# Altium project Timingcard_PROJECT_v9.PrjPcb (part 2 of 2)

## Sheet 05-GPS_IMU_SENSORS.SchDoc
size Tabloid; Customer: 01910; SPICEModelCache: <root> / <DocumentId>YSTRYKDD</DocumentId> / <CacheFrame Number="0"> / <Model Name="emk105bj105_v-f" Kind="CKT"> / <Text>* EMK105BJ105_V-F     SPICE MODEL  ( General Type ) / *-------------------------------------------------------------------------------------------------------- / * Model Generated by TAIYO YUDEN Corporation (http://www.ty-top.com) / * Version 1.0 / * TAIYO YUDEN Control No. 170508_130520 / * Copyright(c) 2012 TAIYO YUDEN CO.,LTD. All Rights Reserved. / *-------------------------------------------------------------------------------------------------------- / * / * Products Name : Multilayer Ceramic Capacitors / * / * Characteristics : / *     Capacitance : 1 uF , Rated Voltage : 16V , TCC : X5R / *     Case Size : 1.0 x 0.5 / 0.039 x 0.02 [mm/inch] , Thickness : 0.5 / 0.02 [mm/inch] / *     (Conditions: Temperature = 25 degC , DC Bias Current/Voltage = 0A / 0V) / * / * Frequency Range : 40Hz - 3GHz / * / * External Node Assignments : / * / *  1  o---| |---o  2 / * / *-------------------------------------------------------------------------------------------------------- / .SubCkt EMK105BJ105_V-F 1 2 / **************************** / C0 1 110 0.68309u / Cm 1 101 0.26053u / C1 101 102 0.94076u / Rc1 101 102 1.9029k / C2 102 103 0.66707u / Rc2 102 103 120.36 / C3 103 110 0.57203u / Rc3 103 110 2.1097 / C2m 1 301 0.1871u / C21 301 302 3.2494u / Rc21 301 302 1.1117k / C22 302 303 2.1014u / Rc22 302 303 1.484k / C23 303 304 2.1172u / Rc23 303 304 1.3876k / C24 304 305 0.75729u / Rc24 304 305 332.59 / C25 305 306 0.94401u / Rc25 305 306 249.09 / C26 306 307 0.34674u / Rc26 306 307 28.352 / C27 307 308 0.37158u / Rc27 307 308 19.989 / C28 308 309 0.17933u / Rc28 308 309 31.748 / C29 309 110 0.016445u / Rc29 309 110 1.0592 / Rp0 1 110 100Meg / L0 110 120 0.2216n / Lm 120 130 0.1509n / L1 120 121 0.12659n / RL1 121 130 0.85161 / L2 120 122 0.15996n / RL2 122 130 0.42469 / L3 120 123 7.9543n / RL3 123 130 0.54643m / CR 120 124 0.24334u / LR 124 125 0.090738n / RR 125 130 68.076m / CL 130 140 2.7354p / LL 130 140 0.10762n / RL 130 140 50.614 / Rs 140 2 7.5416m / **************************** / .ends EMK105BJ105_V-F</Text> / </Model> / </CacheFrame> / </root>
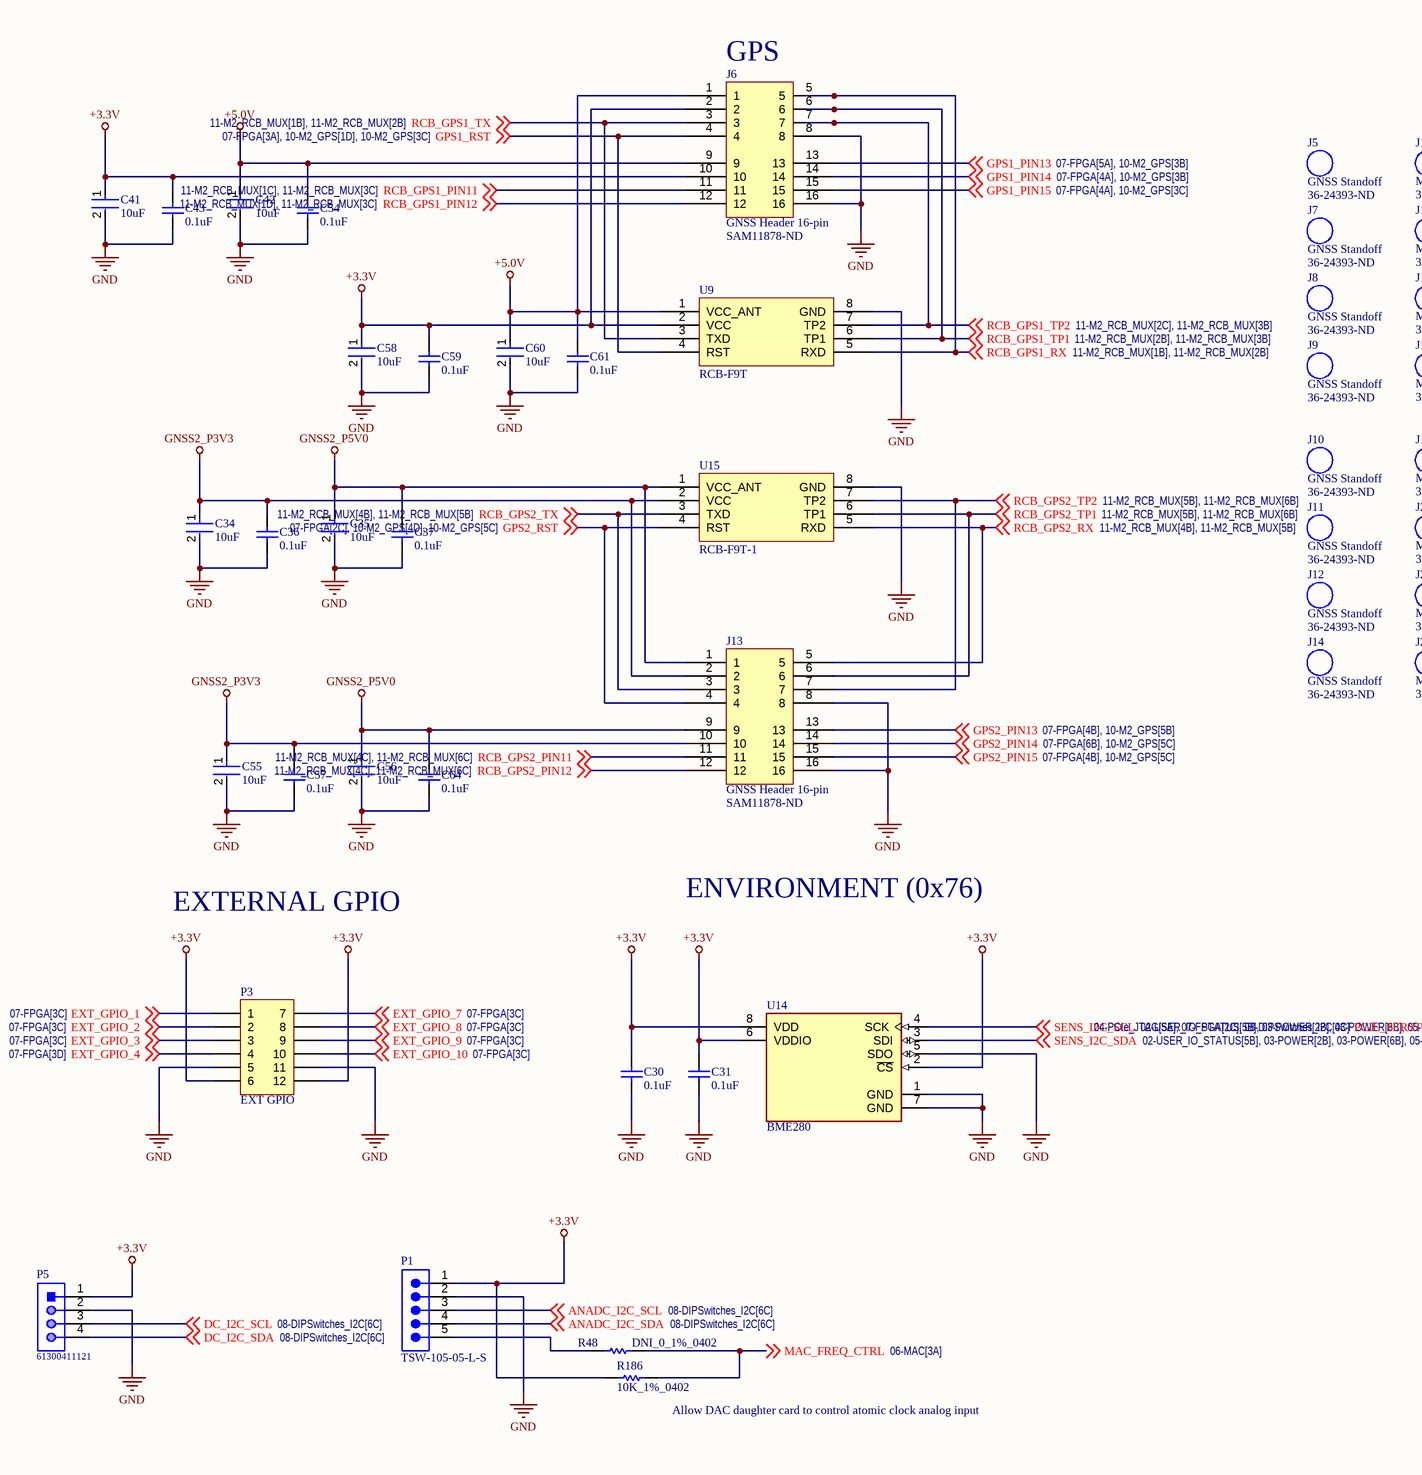
[diagram p3: 05-GPS_IMU_SENSORS.SchDoc, left]
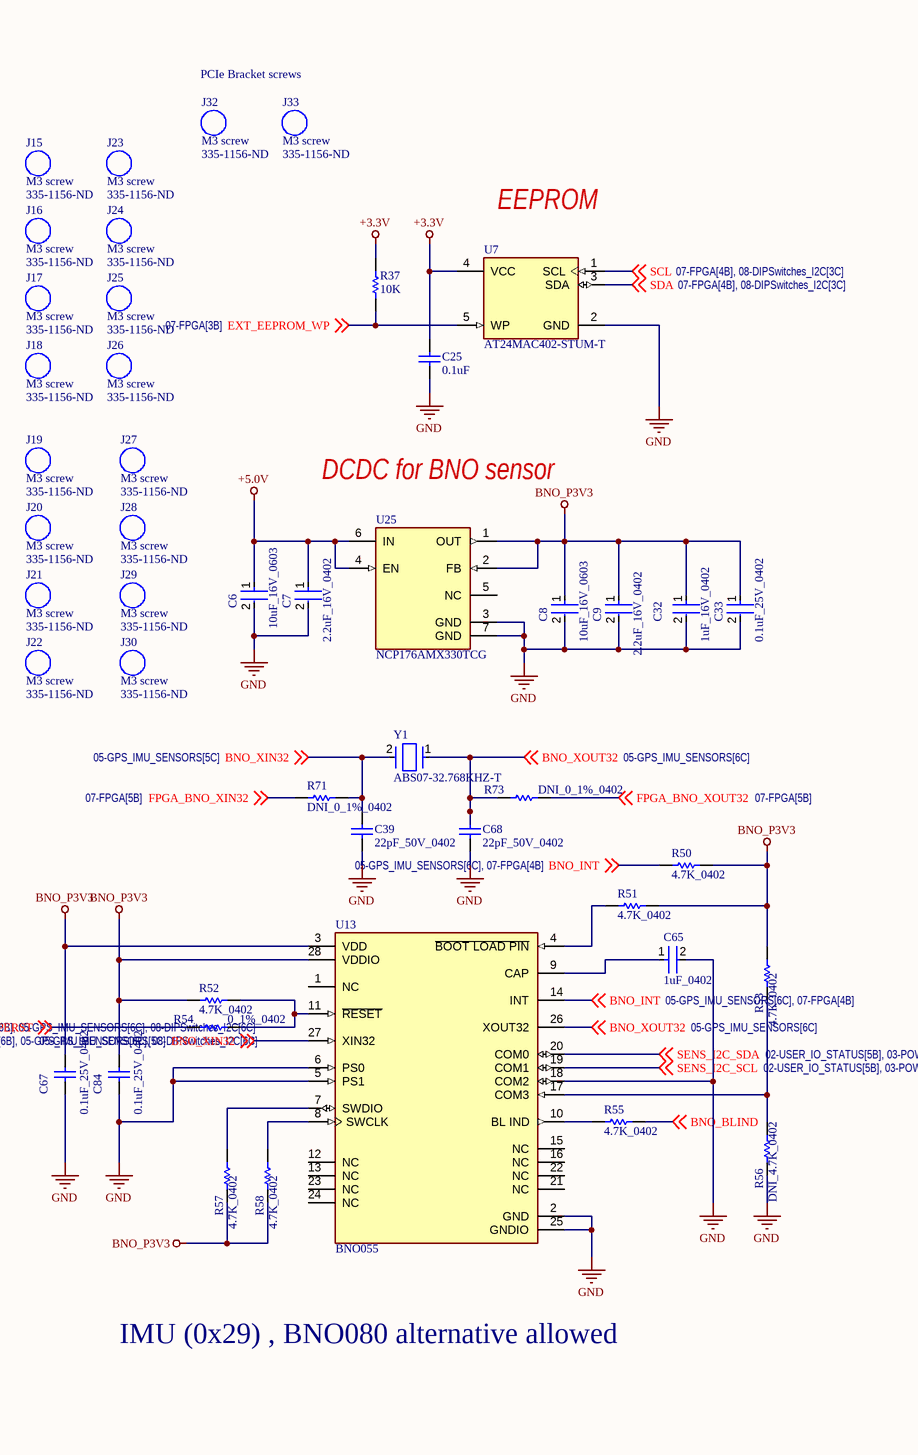
[diagram p4: 05-GPS_IMU_SENSORS.SchDoc, right]

### Parts
C6  10uF_16V_0603  [FP-0603-L_1_6_0_2-W_0_8_0-MFG]
C7  2.2uF_16V_0402  [FP-C1005-050-0_05-IPC_A]
C8  10uF_16V_0603  [FP-0603-L_1_6_0_2-W_0_8_0-MFG]
C9  2.2uF_16V_0402  [FP-C1005-050-0_05-IPC_A]
C25  0.1uF  [CAPC1608X87X45ML20T05]
C30  0.1uF  [CAPC1608X87X45ML20T05]
C31  0.1uF  [CAPC1608X87X45ML20T05]
C32  1uF_16V_0402  [FP-0402-L_1_0_0_05-W_0_5-IPC_A]
C33  0.1uF_25V_0402  [FP-0402-L_1_0_1-W_0_5_0_1-IPC_C]
C34  10uF  [FP-MK212BG-MFG]
C35  10uF  [FP-MK212BG-MFG]
C36  0.1uF  [CAPC1608X87X45ML20T05]
C37  0.1uF  [CAPC1608X87X45ML20T05]
C39  22pF_50V_0402  [CAPC1005X55X25ML05T05]
C41  10uF  [FP-MK212BG-MFG]
C42  10uF  [FP-MK212BG-MFG]
C43  0.1uF  [CAPC1608X87X45ML20T05]
C54  0.1uF  [CAPC1608X87X45ML20T05]
C55  10uF  [FP-MK212BG-MFG]
C56  10uF  [FP-MK212BG-MFG]
C57  0.1uF  [CAPC1608X87X45ML20T05]
C58  10uF  [FP-MK212BG-MFG]
C59  0.1uF  [CAPC1608X87X45ML20T05]
C60  10uF  [FP-MK212BG-MFG]
C61  0.1uF  [CAPC1608X87X45ML20T05]
C64  0.1uF  [CAPC1608X87X45ML20T05]
C65  1uF_0402  [FP-0402-L_1_0_0_05-W_0_5-IPC_C]
C67  0.1uF_25V_0402  [CAPC1005X56X25NL10T15]
C68  22pF_50V_0402  [CAPC1005X55X25ML05T05]
C84  0.1uF_25V_0402  [CAPC1005X56X25NL10T15]
J5  GNSS Standoff  Supplier Part Number 1: 36-24393-ND
J6  GNSS Header 16-pin  Supplier Part Number 1: SAM11878-ND  [GNSS Header 16-pin]
J7  GNSS Standoff  Supplier Part Number 1: 36-24393-ND
J8  GNSS Standoff  Supplier Part Number 1: 36-24393-ND
J9  GNSS Standoff  Supplier Part Number 1: 36-24393-ND
J10  GNSS Standoff  Supplier Part Number 1: 36-24393-ND
J11  GNSS Standoff  Supplier Part Number 1: 36-24393-ND
J12  GNSS Standoff  Supplier Part Number 1: 36-24393-ND
J13  GNSS Header 16-pin  Supplier Part Number 1: SAM11878-ND  [GNSS Header 16-pin]
J14  GNSS Standoff  Supplier Part Number 1: 36-24393-ND
J15  M3 screw  Supplier Part Number 1: 335-1156-ND
J16  M3 screw  Supplier Part Number 1: 335-1156-ND
J17  M3 screw  Supplier Part Number 1: 335-1156-ND
J18  M3 screw  Supplier Part Number 1: 335-1156-ND
J19  M3 screw  Supplier Part Number 1: 335-1156-ND
J20  M3 screw  Supplier Part Number 1: 335-1156-ND
J21  M3 screw  Supplier Part Number 1: 335-1156-ND
J22  M3 screw  Supplier Part Number 1: 335-1156-ND
J23  M3 screw  Supplier Part Number 1: 335-1156-ND
J24  M3 screw  Supplier Part Number 1: 335-1156-ND
J25  M3 screw  Supplier Part Number 1: 335-1156-ND
J26  M3 screw  Supplier Part Number 1: 335-1156-ND
J27  M3 screw  Supplier Part Number 1: 335-1156-ND
J28  M3 screw  Supplier Part Number 1: 335-1156-ND
J29  M3 screw  Supplier Part Number 1: 335-1156-ND
J30  M3 screw  Supplier Part Number 1: 335-1156-ND
J32  M3 screw  Supplier Part Number 1: 335-1156-ND
J33  M3 screw  Supplier Part Number 1: 335-1156-ND
P1  TSW-105-05-L-S  [SMTC-TSW-105-05-X-S]
P3  EXT GPIO  [HDR2X6_CEN]
P5  61300411121  [61300411121]
R37  10K  [RESC1608X55X30LL15T20]
R48  DNI_0_1%_0402  [RESC1005X40X25LL05T05]  (no BOM)
R50  4.7K_0402  [RESC1005X40X25LL05T05]
R51  4.7K_0402  [RESC1005X40X25LL05T05]
R52  4.7K_0402  [RESC1005X40X25LL05T05]
R53  4.7K_0402  [RESC1005X40X25LL05T05]
R54  0_1%_0402  [RESC1005X40X25LL05T05]
R55  4.7K_0402  [RESC1005X40X25LL05T05]
R56  DNI_4.7K_0402  [RESC1005X40X25LL05T05]  (no BOM)
R57  4.7K_0402  [RESC1005X40X25LL05T05]
R58  4.7K_0402  [RESC1005X40X25LL05T05]
R71  DNI_0_1%_0402  [RESC1005X40X25LL05T05]  (no BOM)
R73  DNI_0_1%_0402  [RESC1005X40X25LL05T05]  (no BOM)
R186  10K_1%_0402  [RESC1005X40X25LL05T10]
U7  AT24MAC402-STUM-T  [FP-5TS1-IPC_C]
U9  RCB-F9T  [GNSS]
U13  BNO055  [FP-BNO055-MFG]
U14  BME280  [FP-BME280-MFG]
U15  RCB-F9T-1  [GNSS]
U25  NCP176AMX330TCG  [FP-711AT-MFG]
Y1  ABS07-32.768KHZ-T  [FP-ABS07-MFG]

### Nets
+3.3V: C25.2 C30.2 C31.2 C41.1 C43.2 C58.1 C59.2 J6.2 J6.10 P1.1 P3.6 P3.12 P5.1 R37.2 R186.1 U7.4(VCC) U9.2(VCC) U14.2(~{CS}) U14.6(VDDIO) U14.8(VDD)
+5.0V: C6.1 C7.1 C42.1 C54.2 C60.1 C61.2 J6.1 J6.9 U9.1(VCC_ANT) U25.4(EN) U25.6(IN)
BNO_P3V3: C8.1 C9.1 C32.1 C33.1 C67.2 C84.2 R50.1 R51.1 R52.2 R53.2 R57.1 R58.1 U13.3(VDD) U13.28(VDDIO) U25.1(OUT) U25.2(FB)
GND: C6.2 C7.2 C8.2 C9.2 C25.1 C30.1 C31.1 C32.2 C33.2 C34.2 C35.2 C36.1 C37.1 C39.1 C41.2 C42.2 C43.1 C54.1 C55.2 C56.2 C57.1 C58.2 C59.1 C60.2 C61.1 C64.1 C65.2 C67.1 C68.1 C84.1 J6.8 J6.16 J13.8 J13.16 P1.2 P3.5 P3.11 P5.2 R56.1 U7.2(GND) U9.8(GND) U13.2(GND) U13.5(PS1) U13.6(PS0) U13.18(COM2) U13.25(GNDIO) U14.1(GND) U14.5(SDO) U14.7(GND) U15.8(GND) U25.3(GND) U25.7(GND)
GNSS2_P3V3: C34.1 C36.2 C55.1 C57.2 J13.2 J13.10 U15.2(VCC)
GNSS2_P5V0: C35.1 C37.2 C56.1 C64.2 J13.1 J13.9 U15.1(VCC_ANT)
ANADC_I2C_SCL: P1.3 ; off-sheet ANADC_I2C_SCL
ANADC_I2C_SDA: P1.4 ; off-sheet ANADC_I2C_SDA
BNO_BLIND: R55.1 ; off-sheet BNO_BLIND
BNO_INT: R50.2 U13.14(INT) ; off-sheet BNO_INT
BNO_XIN32: C39.2 R71.1 U13.27(XIN32) Y1.2 ; off-sheet BNO_XIN32
BNO_XOUT32: C68.2 R73.1 U13.26(XOUT32) Y1.1 ; off-sheet BNO_XOUT32
DC_I2C_SCL: P5.3 ; off-sheet DC_I2C_SCL
DC_I2C_SDA: P5.4 ; off-sheet DC_I2C_SDA
EXT_EEPROM_WP: R37.1 U7.5(WP) ; off-sheet EXT_EEPROM_WP
EXT_GPIO_1: P3.1 ; off-sheet EXT_GPIO_1
EXT_GPIO_2: P3.2 ; off-sheet EXT_GPIO_2
EXT_GPIO_3: P3.3 ; off-sheet EXT_GPIO_3
EXT_GPIO_4: P3.4 ; off-sheet EXT_GPIO_4
EXT_GPIO_7: P3.7 ; off-sheet EXT_GPIO_7
EXT_GPIO_8: P3.8 ; off-sheet EXT_GPIO_8
EXT_GPIO_9: P3.9 ; off-sheet EXT_GPIO_9
EXT_GPIO_10: P3.10 ; off-sheet EXT_GPIO_10
FPGA_BNO_XIN32: R71.2 ; off-sheet FPGA_BNO_XIN32
FPGA_BNO_XOUT32: R73.2 ; off-sheet FPGA_BNO_XOUT32
GPS1_PIN13: J6.13 ; off-sheet GPS1_PIN13
GPS1_PIN14: J6.14 ; off-sheet GPS1_PIN14
GPS1_PIN15: J6.15 ; off-sheet GPS1_PIN15
GPS1_RST: J6.4 U9.4(RST) ; off-sheet GPS1_RST
GPS2_PIN13: J13.13 ; off-sheet GPS2_PIN13
GPS2_PIN14: J13.14 ; off-sheet GPS2_PIN14
GPS2_PIN15: J13.15 ; off-sheet GPS2_PIN15
GPS2_RST: J13.4 U15.4(RST) ; off-sheet GPS2_RST
MAC_FREQ_CTRL: R48.2 R186.2 ; off-sheet MAC_FREQ_CTRL
PCIE_PERST: R54.1 ; off-sheet PCIE_PERST
RCB_GPS1_PIN11: J6.11 ; off-sheet RCB_GPS1_PIN11
RCB_GPS1_PIN12: J6.12 ; off-sheet RCB_GPS1_PIN12
RCB_GPS1_RX: J6.5 U9.5(RXD) ; off-sheet RCB_GPS1_RX
RCB_GPS1_TP1: J6.6 U9.6(TP1) ; off-sheet RCB_GPS1_TP1
RCB_GPS1_TP2: J6.7 U9.7(TP2) ; off-sheet RCB_GPS1_TP2
RCB_GPS1_TX: J6.3 U9.3(TXD) ; off-sheet RCB_GPS1_TX
RCB_GPS2_PIN11: J13.11 ; off-sheet RCB_GPS2_PIN11
RCB_GPS2_PIN12: J13.12 ; off-sheet RCB_GPS2_PIN12
RCB_GPS2_RX: J13.5 U15.5(RXD) ; off-sheet RCB_GPS2_RX
RCB_GPS2_TP1: J13.6 U15.6(TP1) ; off-sheet RCB_GPS2_TP1
RCB_GPS2_TP2: J13.7 U15.7(TP2) ; off-sheet RCB_GPS2_TP2
RCB_GPS2_TX: J13.3 U15.3(TXD) ; off-sheet RCB_GPS2_TX
SCL: U7.1(SCL) ; off-sheet SCL
SDA: U7.3(SDA) ; off-sheet SDA
SENS_I2C_SCL: U13.19(COM1) U14.4(SCK) ; off-sheet SENS_I2C_SCL
SENS_I2C_SDA: U13.20(COM0) U14.3(SDI) ; off-sheet SENS_I2C_SDA
NetC65_1: C65.1 U13.9(CAP)
NetP1_5: P1.5 R48.1
NetR51_2: R51.2 U13.4(~{BOOT_LOAD_PIN})
NetR52_1: R52.1 R54.2 U13.11(~{RESET})
NetR53_1: R53.1 R56.2 U13.17(COM3)
NetR55_2: R55.2 U13.10(BL_IND)
NetR57_2: R57.2 U13.7(SWDIO)
NetR58_2: R58.2 U13.8(SWCLK)

Not connected (* = marked no-connect by the designer): U13 1(NC) 12(NC) 13(NC) 15(NC) 16(NC) 21(NC) 22(NC) 23(NC) 24(NC); U25 5(NC)

### Notes on the sheet
- (near J6) GPS
- PCIe Bracket screws
- EEPROM
- DCDC for BNO sensor
- ENVIRONMENT (0x76)
- EXTERNAL GPIO
- IMU (0x29) , BNO080 alternative allowed
- (near R186) Allow DAC daughter card to control atomic clock analog input
- SHEET
- REV
- timingcard.com <http://timingcard.com>
- DATE
- OF

### Library data of the parts
C6 C8 = CMP-2000-06226-4: Multilayer Ceramic Capacitor 10uF 16V X5R 20% SMD 0603 T/R; Packaging: Tape and Reel; Construction: Flat; Height: 0.8mm; Max Operating Temperature: 85°C; Dielectric: X5R; Case Code (Metric): 1608; Voltage Rating (DC): 16V; Width: 0.031inch; Voltage Rating: 16V; Length: 0.063inch; RoHS Compliant: Yes; Halogen Free: Halogen Free; Case Code (Imperial): 0603; Capacitance: 10uF; Mount: Surface Mount; Thickness: 0.031inch; Tolerance: 20%; Min Operating Temperature: -55°C; Series: M; Termination: SMD/SMT; Case/Package: 0603; Package Quantity: 1
C7 C9 = CMP-2000-05998-2: Multilayer Ceramic Capacitors 2.2μF ±10% 16V X5R SMD 0402; Capacitance: 2.2uF; REACH SVHC: No SVHC; Series: C; Termination: SMD/SMT; Case Code (Imperial): 0402; Depth: 0.5mm; Mount: Surface Mount; Width: 0.02inch; Package Quantity: 1; Dielectric Material: Ceramic; Length: 1mm; Packaging: Tape and Reel; Case Code (Metric): 1005; RoHS Compliant: Yes; Dielectric: X5R; Max Operating Temperature: 85°C; Lead Free: Lead Free; Weight: 2.3E-05oz; Thickness: 0.022inch; Voltage Rating (DC): 16V; Tolerance: 10%; Voltage Rating: 16V; Resistor Type: Ceramic; Height: 0.5mm; Case/Package: 0402; Min Operating Temperature: -55°C
C25 C30 C31 C36 C37 C43 C54 C57 C59 C61 C64 = CMP-2006-00003-1: C0603X104K5RACAUTO; Manufacturer: Kemet; Part Number: C0603X104K5RACAUTO
C32 = CMP-14477-000104-2: None; Tolerance: 10%; Voltage Rating: 16V; Dielectric: X5R; Capacitance: 1uF; Packaging: Tape and Reel; Depth: 0.5mm; Mount: Surface Mount; Thickness: 0.022inch; Package Quantity: 1; Min Operating Temperature: -55°C; Series: M; Voltage Rating (DC): 16V; Termination: SMD/SMT; Case/Package: 0402; Number of Pins: 2; Case Code (Imperial): 0402; Length: 1mm; Halogen Free: Halogen Free; Case Code (Metric): 1005; Width: 0.02inch; RoHS Compliant: Yes; Radiation Hardening: No; Max Operating Temperature: 85°C; Height: 0.5mm; Construction: Flat
C33 = CMP-2008-02519-2: General Purpose Ceramic Capacitor, 0402, 100nF, 10%, X7R, 15%, 25V; Package Quantity: 1; Capacitance: 100nF; Min Operating Temperature: -55°C; Voltage: 25V; Voltage Rating: 25V; Construction: Flat; Max Operating Temperature: 125°C; Radiation Hardening: No; Depth: 0.5mm; Thickness: 0.022inch; Voltage Rating (DC): 25V; Number of Pins: 2; Lead Free: Lead Free; Series: -; REACH SVHC: No SVHC; Length: 1mm; Dielectric: X7R; RoHS Compliant: Yes; Mount: Surface Mount; Packaging: Tape and Reel; Case/Package: 0402; Case Code (Imperial): 0402; Termination: SMD/SMT; Width: 0.02inch; Case Code (Metric): 1005; Tolerance: 10%
C34 C35 C41 C42 C55 C56 C58 C60 = CMP-14477-000079-2: None; Voltage Rating (DC): 25V; Tolerance: 10%; Dielectric: X7R; Voltage: 16V; Packaging: Tape and Reel; Capacitance: 10uF; Thickness: 0.053inch; Resistor Type: Ceramic; RoHS Compliant: Yes; Lead Free: Lead Free; REACH SVHC: No SVHC; Number of Pins: 2; Package Quantity: 1; Mount: Surface Mount; Termination: SMD/SMT; Width: 0.049inch; Max Operating Temperature: 85°C; Length: 0.079inch; Case/Package: 0805; Voltage Rating: 25V; Min Operating Temperature: -55°C; Case Code (Metric): 2012; Case Code (Imperial): 0805; Height: 1.25mm; Series: M
C39 C68 = CMP-2100-03590-1: Chip Capacitor, 22 pF, +/- 5%, 50 V, -55 to 125 degC, 0402 (1005 Metric), RoHS, Tape and Reel; Manufacturer: Yageo; Voltage Rating: 50V; Dielectric Material: Ceramic; Capacitance: 22pF; Temperature Coefficient: 30ppm/degC; Dielectric: C0G; Insulation Resistance: 100GR; Datasheet URL: http://www.yageo.com/NewPortal/yageodocoutput?fileName=/pdf/MLCC/UPY-GP_NP0_16V-to-50V_14.pdf; Depth: 0.5mm; Number of Pins: 2; Height: 0.5mm; Min Operating Temperature: -55degC; REACH SVHC: NoSVHC; Max Operating Temperature: 125degC; Voltage Rating (DC): 50V; Composition: Ceramic; Packaging: TapeandReel; Package Quantity: 1; Package Reference: 0402; Length: 1mm; Radiation Hardening: No; Package Description: 2-Pin Surface Mount Device, Body 1 x 0.5 mm; RoHSCompliant: True; Thickness: 0.022inch; Manufacturer URL: http://www.yageo.com/; Mount: SurfaceMount; Case Code (Metric): 1005; Case/Package: 0402; Tolerance: 5%; Termination: SMD/SMT; Width: 0.02inch; Datasheet Version: Rev. 14, 07/2016; Lead Free: LeadFree; Case Code (Imperial): 0402
C65 = CMP-14477-003537-2: None; Tolerance: 20%; Voltage Rating (DC): 16V; Capacitance: 1uF; Dielectric: X5R; Height: 0.5mm; Package Quantity: 10000; Series: M; Max Operating Temperature: 85°C; Width: 0.02inch; Mount: Surface Mount; Thickness: 0.022inch; Length: 1mm; Min Operating Temperature: -55°C; Depth: 0.5mm; RoHS Compliant: Yes; Construction: Flat; Case/Package: 0402; Radiation Hardening: No; Packaging: Tape and Reel; Voltage: 16V; Voltage Rating: 16V; Halogen Free: Halogen Free
C67 C84 = CMP-1034-02072-2: Part Number: 04023D104KAT2A; Manufacturer: AVX Interconnect / Elco
P1 = CMP-1024-00366-1: 0.025" SQ Post Header, Through-hole, Vertical, -55 to 125 degC, 2.54 mm Pitch, 5-Pin, Male, RoHS; Manufacturer: Samtec; Pitch: 2.54 mm; PackageVersion: DM, 8/1988; PartNumber: TSW-105-05-L-S; Orientation: Vertical; Temperature Range: -55 to 125 degC; ComponentLink1Description: Manufacturer URL; PackageDescription: .025[0.64] SQ. Post Terminal Strip Assembly; ComponentLink2URL: http://www.samtec.com/documents/webfiles/pdf/TSW_TH.PDF; PackageReference: TSW-105-05-X-S; ComponentLink2Description: Datasheet; Mounting Technology: Through-hole; DatasheetVersion: F-214; ComponentLink1URL: http://www.samtec.com; RoHS: True; ComponentLink3URL: http://www.samtec.com/documents/webfiles/cpdf/TSW-XXX-XX-XXX-X-XX-XXX-MKT.pdf; ComponentLink3Description: Package Specification
P3 = Header 6X2A: Header, 6-Pin, Dual row; LatestRevisionDate: 17-Jul-2002; LatestRevisionNote: Re-released for DXP Platform.; Publisher: Altium Limited
P5 = CMP-1502-01064-1: THT Vertical Pin Header WR-PHD, Pitch 2.54 mm, Single Row, 4 pins; Manufacturer: Wurth Elektronik; Withstanding Voltage: 500VAC; Rated Current: 3A; Working Voltage: 250VAC; Pin Number: 4; Gender: Male; Contact Resistance: 20mOhm; Pitch: 2.54mm; Manufacturer URL: http://www.we-online.de; Operating Temperature: -40to105degC; Packaging: Bag; Mounting Technology: THT; Package Reference: 61300411121; Datasheet URL: https://katalog.we-online.de/em/datasheet/6130xx11121.pdf; Publisher: WurthElektronik; Part Number: 61300411121; Row Number: Single; Orientation: Vertical
R37 = CMP-2000-06990-1: Chip Resistor, 10 KOhm, +/- 1%, 0.1 W, -55 to 155 degC, 0603 (1608 Metric), RoHS, Tape and Reel RMCF0603FT10K0; Manufacturer: Stackpole-Electronics-Inc.; Temperature Coefficient: ±100ppm/°C; Power (Watts): 0.1W,1/10W; Package / Case: 0603(1608Metric); Datasheet Version: 01/2017; Resistance (Ohms): 10k; Features: AutomotiveAEC-Q200; Packaging: CutTape(CT); Series: RMCF; Height: 0.022"(0.55mm); Tolerance: ±1%; Manufacturer URL: https://www.seielect.com/; Datasheet URL: https://www.seielect.com/Catalog/SEI-RMCF_RMCP.pdf; Supplier Device Package: 0603; Number of Terminations: 2; Family: ChipResistor-SurfaceMount; Package Reference: 0603; Size / Dimension: 0.061"Lx0.031"W(1.55mmx0.80mm); Mounting Technology: SurfaceMount; Package Description: 2-Pin Surface Mount Device, Body 1.55 x 0.8 mm; Operating Temperature: -55°C~155°C; Composition: ThickFilm; Category: Resistors
R48 R54 R71 R73 = CMP-2000-07451-1: Chip Resistor, 0 Ohm, 0.1 W, -55 to 155 degC, 0402 (1005 Metric), RoHS, Tape and Reel; Manufacturer: Panasonic; Voltage Rating (DC): 50V; Temperature Coefficient: 600ppm/��C; Max Power Dissipation: 100mW; Resistance: 0mOhm; Tolerance: 5%; Number of Terminations: 2; Mount: SurfaceMount; Height: 0.35mm; Packaging: TapeandReel; Contact Plating: Tin; Manufacturer URL: http://www.panasonic.com/; Composition: ThickFilm; Max Operating Temperature: 155degC; REACH SVHC: NoSVHC; Case/Package: 0402; Package Reference: 402; Depth: 0.5mm; Package Description: 2-Pin Surface Mount Device, Body 1 x 0.5 mm; Datasheet URL: https://industrial.panasonic.com/cdbs/www-data/pdf/RDA0000/AOA0000C301.pdf; RoHSCompliant: True; Case Code (Imperial): 0402; Military Standard: Not; Min Operating Temperature: -55degC; Power Rating: 100mW; Datasheet Version: 03/2015; Length: 1mm; Case Code (Metric): 1005; Termination: SMD/SMT; Mounting Technology: SurfaceMount; Voltage Rating: 50V; Width: 0.02inch; Package Quantity: 1; Lead Free: LeadFree; Radiation Hardening: No
R50-R53 R55-R58 = CMP-2002-01154-4: Chip Resistor, 4.7 KOhm, +/- 1%, 0.1 W, -55 to 155 degC, 0402 (1005 Metric), RoHS, Tape and Reel; PartNumber: ERJ-2RKF4701X; Voltage Rating: 50 V; Case\/Package: 0402; Power Rating: 100 mW; Height: 0.35 mm; Mounting Technology: Surface Mount; REACH SVHC: Yes; Resistance: 4.7 KOhm; Max Operating Temperature: 155 degC; ComponentLink1Description: Manufacturer URL; ComponentLink2Description: Datasheet; Pins: 2; PackageReference: 0402; Tolerance: 1%; Case Code (Imperial): 0402; Length: 1 mm; PackageDescription: 2-Pin Surface Mount Device, Body 1 x 0.5 mm; RoHSCompliant: true; Package Quantity: 1; Radiation Hardening: No; DatasheetVersion: 04/2015; Width: 0.5 mm; Case Code (Metric): 1005; Mount: Surface Mount; ComponentLink1URL: http://www.panasonic.com/; Min Operating Temperature: -55 degC; Packaging: Cut Tape; ComponentLink2URL: http://industrial.panasonic.com/cdbs/www-data/pdf/RDA0000/AOA0000C86.pdf
R186 = CMP-2002-07353-1: Part Number: RC0402FR-0710KL; Manufacturer: Yageo / Phycomp
U7 = CMP-06313-000011-1: IC EEPROM 2K I2C 1MHZ SOT23-5; Manufacturer: Microchip; Memory Size: 2Kbits; Min Supply Voltage: 1.7V; Max Supply Voltage: 5.5V; Frequency: 1000kHz; Standoff Height: 0mm; Nominal Supply Current: 0.4-2mA; Access Time: 0.55us; Interface: I2C,2-Wire; Temperature Range Low: -40°C; Height: 1mm; ComponentLink2URL: http://ww1.microchip.com/downloads/en/DeviceDoc/Atmel-8807-SEEPROM-AT24MAC402-602-Datasheet.pdf; Ipc Land Pattern Name: SOT95P280X100-5; Category: IC; Memory Type: EEPROM; Digikey Description: IC EEPROM 2K I2C 1MHZ SOT23-5; Manufacturer Part Number: AT24MAC402-STUM-T; Device Class L1: Integrated Circuits (ICs); Temperature Range High: +85°C; ComponentLink2Description: Datasheet; RoHS: TRUE; Mouser Description: EEPROM Serial-I2C 2K-bit 256 x 8 1.8V/2.5V/3.3V/5V 5-Pin SOT-23 T/R; Octopart: https://octopart.com/at24mac402-stum-t-microchip-77758112; Temperature: -40°C to +85°C; Package: 5TS1; Device Class L3: EEPROM; Automotive: No; Device Class L2: Memory; Lead Free: Yes
U9 U15 = RCB-F9T: MOD, GPS; VELENTIUM PART NUM: <V PART NUM>; MFG NAME: UBLOCKS; MINTEMP: -40C; MAXTEMP: 80C; DESC: MOD BLE 4.2; CATEGORY: MOD; MODIFY DATE: 9/11/13; P1: GPS; SHEETPART: *; DATE: .; Supplier 1: Digi-Key; Supplier Part Number 1: 672-RCB-F9T-ND
  U9: MFG PART NUM: RCB-F9T
  U15: MFG PART NUM: RCB-F9T-1
U13 = CMP-2000-05075-4: IMU ACCEL/GYRO/MAG I2C 28LGA; Sensor Type: Accelerometer; Packaging: Tape and Reel; Case/Package: LGA; Min Operating Temperature: -40°C; Mount: Surface Mount; Output Type: I2C; Lead Free: Lead Free; Max Operating Temperature: 85°C
U14 = CMP-2000-05073-3: SENSOR PRESSURE HUMIDITY TEMP; Sensor Type: Temperature; Accuracy: 3%; Response Time: 1s; Output Type: SPI; Min Operating Temperature: -40°C; Max Operating Temperature: 85°C; Case/Package: LGA; Packaging: Cut Tape; Mount: Surface Mount; Lead Free: Lead Free; Number of Pins: 8
U25 = CMP-07128-000022-1: IC REG LINEAR 3.3V 500MA 6XDFN; Manufacturer: ON Semiconductor; Output Type: Fixed; Dropout Voltage: 295mV; Number Of Outputs: 1; Standoff Height: 0mm; Min Supply Voltage: 1.4V; Nominal Supply Current: 60uA; Max Supply Voltage: 5.5V; Max Junction Temp: +150°C; Accuracy Percentage: 0.8%; Footprint Url: https://www.onsemi.com/pub/Collateral/711AT.PDF; Device Class L2: Power Management ICs; Device Class L1: Integrated Circuits (ICs); Digikey Description: IC REG LINEAR 3.3V 500MA 6XDFN; ComponentLink2Description: Datasheet; Output Voltage: 3.3V; ComponentLink2URL: https://www.onsemi.com/pub/Collateral/NCP176-D.PDF; RoHS: TRUE; Lead Free: Yes; Output Current: 500mA; Automotive: No; Temperature Range High: +150°C; Height: 0.45mm; Package: 711AT; Device Class L3: Voltage Regulators - Linear; Octopart: https://octopart.com/ncp176amx330tcg-on+semiconductor-61522616; Category: IC; Manufacturer Part Number: NCP176AMX330TCG; Ipc Land Pattern Name: DFN120X120X37-6; Temperature: to +150°C
Y1 = CMP-0447-00001-4: Crystal 32.768kHz ±20ppm (Tol) 12.5pF FUND 70kΩ 2-Pin CSMD T/R; ESR (Equivalent Series Resistance): 70kR; Radiation Hardening: No; Frequency: 32.768kHz; Length: 3.2mm; Max Operating Temperature: 85°C; Number of Pins: 2; Series: ABS07; Min Operating Temperature: -40°C; Frequency Tolerance: 20ppm; Packaging: Tape and Reel; Height: 0.9mm; Width: 1.5mm; Depth: 1.5mm; Load Capacitance: 12.5pF; RoHS Compliant: Yes; Tolerance: 20ppm; Termination: SMD/SMT; Lead Free: Lead Free; Series Resistance: 70kR; REACH SVHC: No SVHC; Case/Package: CSMD; Operating Frequency: 32.768 kHz; Package Quantity: 3000
J5 J7-J12 J14 = GNSS Standoff: Supplier 1: Digi-Key
J6 J13 = GNSS Header 16-pin: Supplier 1: Digi-Key
J15-J30 J32 J33 = M3 screw: Supplier 1: Digi-Key

## Sheet 06-MAC.SchDoc
size Tabloid; Customer: 01910
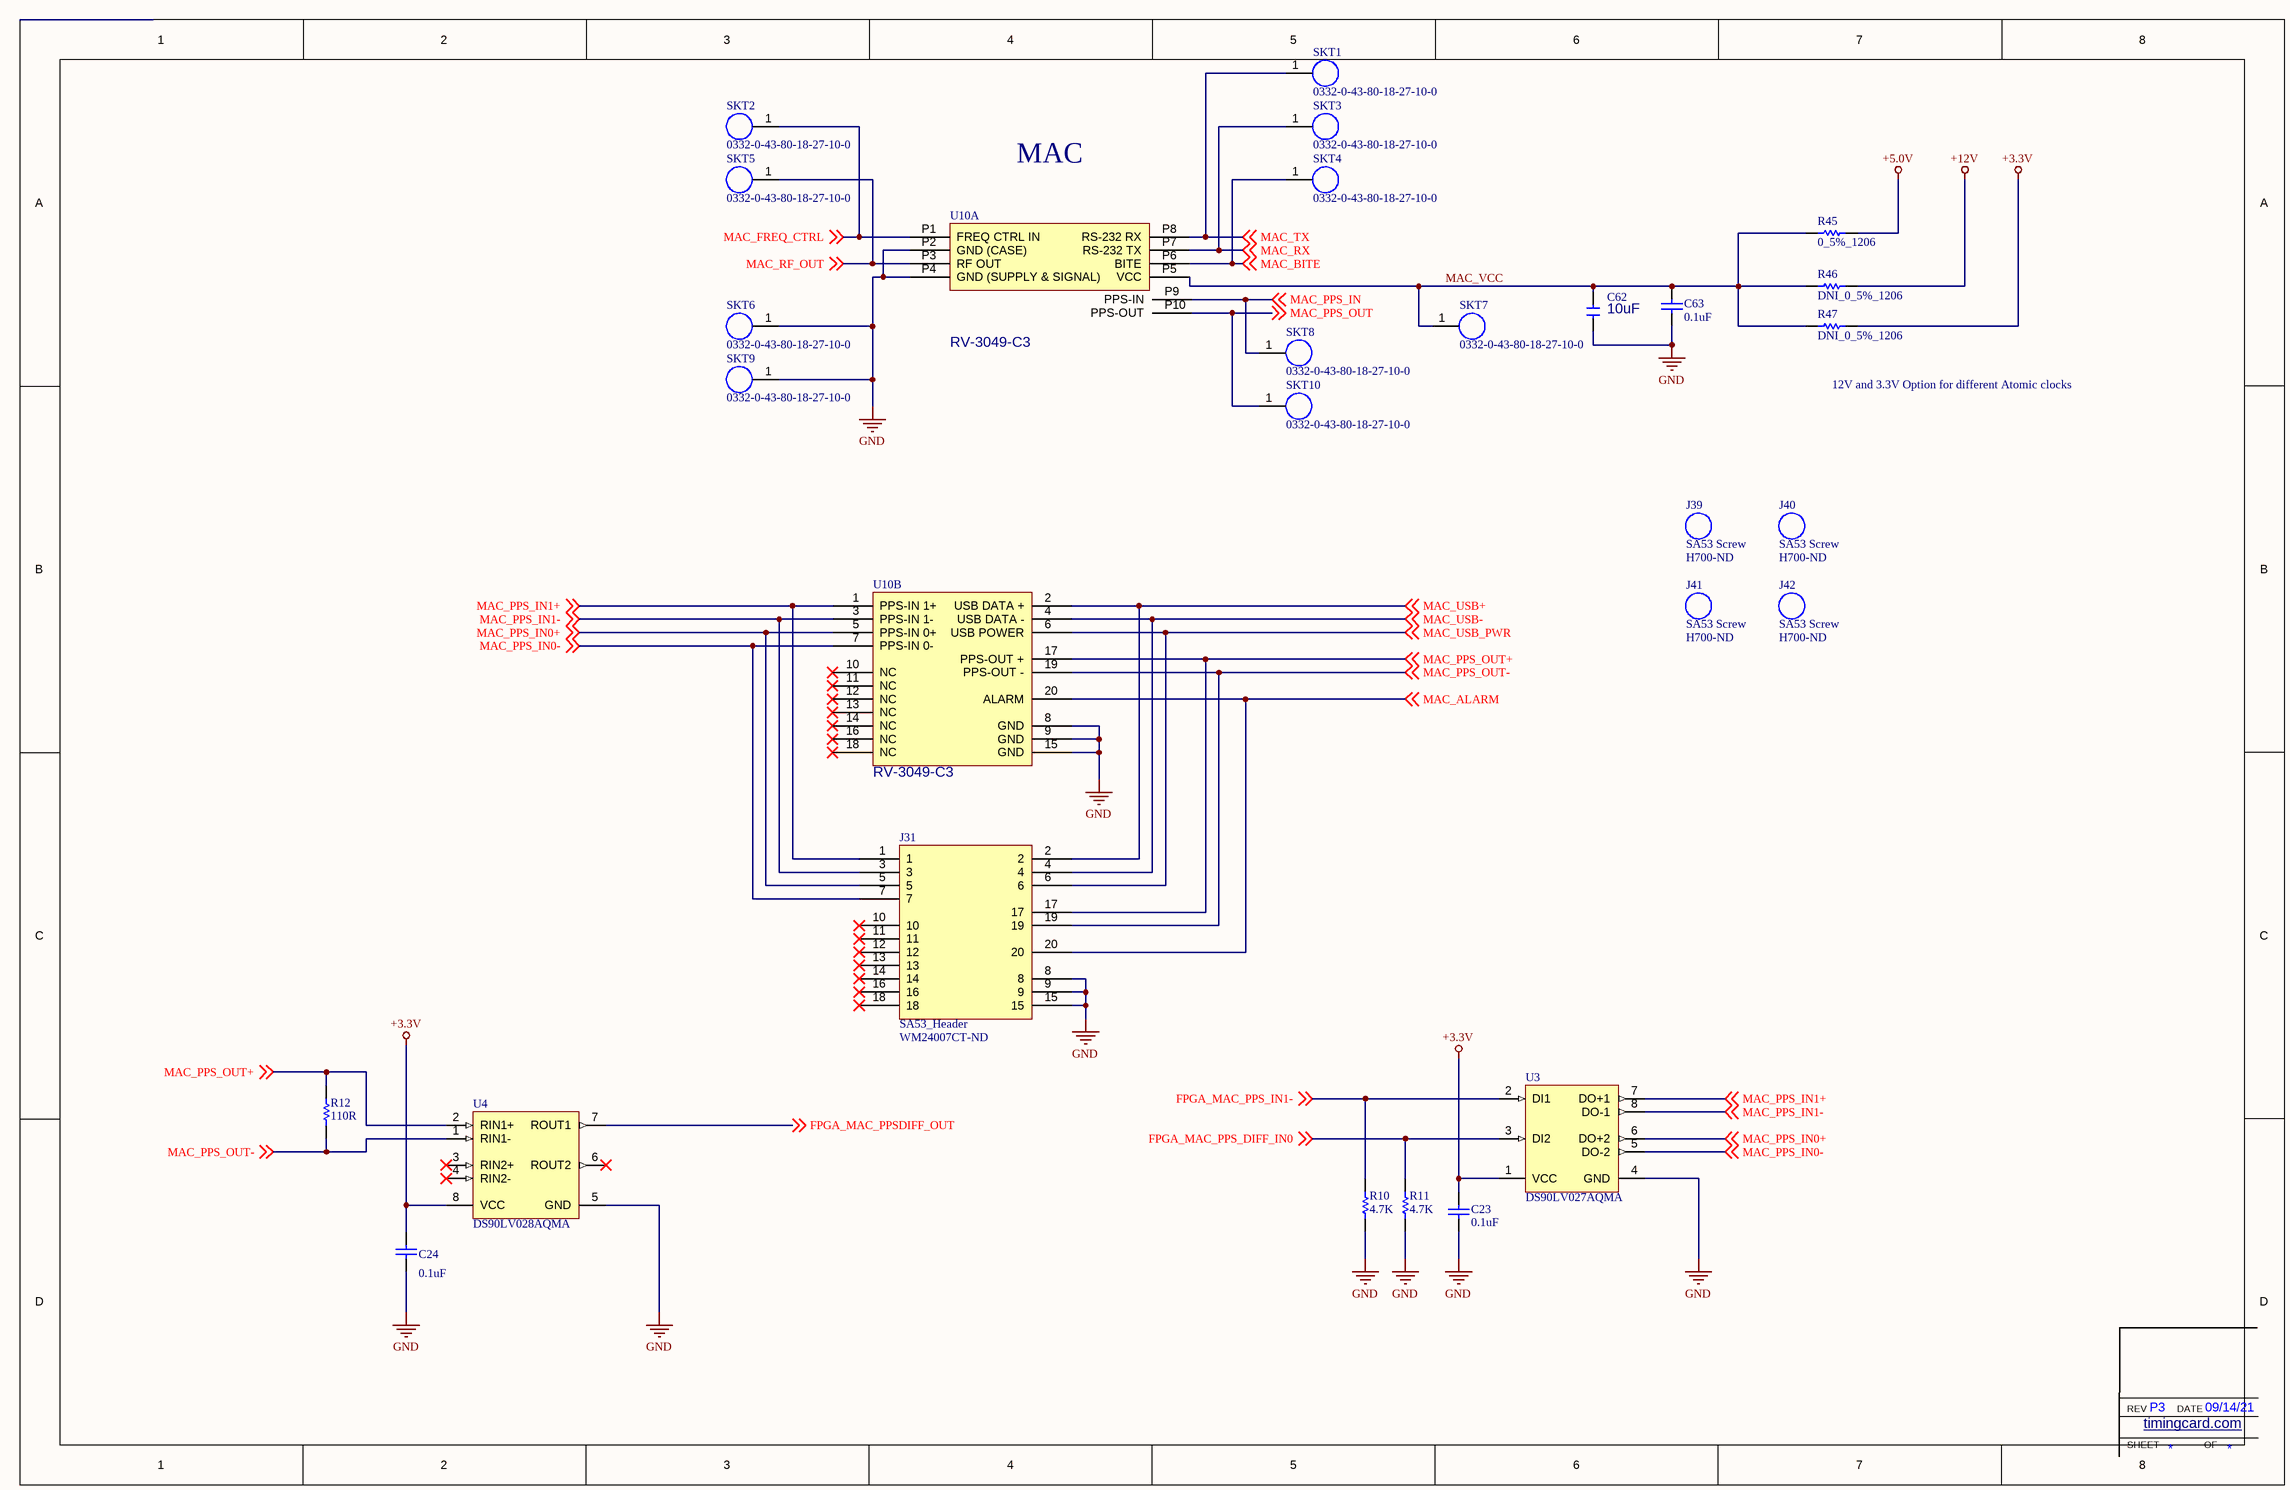
[diagram p5: 06-MAC.SchDoc]

### Parts
C23  0.1uF  [CAPC1608X87X45ML20T05]
C24  0.1uF  [CAPC1608X87X45ML20T05]
C62  value 10uF  [CAPC2012X14N]  (hidden comment: CAP_0805_10UF_25V)
C63  0.1uF  [CAPC1608X87X45ML20T05]
J31  SA53_Header  Supplier Part Number 1: WM24007CT-ND  [SA53_Header]
J39  SA53 Screw  Supplier Part Number 1: H700-ND
J40  SA53 Screw  Supplier Part Number 1: H700-ND
J41  SA53 Screw  Supplier Part Number 1: H700-ND
J42  SA53 Screw  Supplier Part Number 1: H700-ND
R10  4.7K  [RESC1608X55X25LL10T15]
R11  4.7K  [RESC1608X55X25LL10T15]
R12  110R  [RESC1609X50X30NL10T20]
R45  0_5%_1206  [RESC3116X65X50ML20T20]
R46  DNI_0_5%_1206  [RESC3116X65X50ML20T20]  (no BOM)
R47  DNI_0_5%_1206  [RESC3116X65X50ML20T20]  (no BOM)
SKT1  0332-0-43-80-18-27-10-0  [SolderSocket]
SKT2  0332-0-43-80-18-27-10-0  [SolderSocket]
SKT3  0332-0-43-80-18-27-10-0  [SolderSocket]
SKT4  0332-0-43-80-18-27-10-0  [SolderSocket]
SKT5  0332-0-43-80-18-27-10-0  [SolderSocket]
SKT6  0332-0-43-80-18-27-10-0  [SolderSocket]
SKT7  0332-0-43-80-18-27-10-0  [SolderSocket]
SKT8  0332-0-43-80-18-27-10-0  [SolderSocket]
SKT9  0332-0-43-80-18-27-10-0  [SolderSocket]
SKT10  0332-0-43-80-18-27-10-0  [SolderSocket]
U3  DS90LV027AQMA  [M08A_N]
U4  DS90LV028AQMA  [M08A_L]
U10  value RV-3049-C3  [SA53]  (hidden comment: MAC-SA5X)  (parts A,B of 2)

### Nets
+3.3V: C23.2 C24.1 R47.2 U3.1(VCC) U4.8(VCC)
+5.0V: R45.2
+12V: R46.2
GND: C23.1 C24.2 C62.2 C63.1 J31.8 J31.9 J31.15 R10.1 R11.1 SKT6.1 SKT9.1 U3.4(GND) U4.5(GND) U10.8(GND) U10.9(GND) U10.15(GND) U10.P2(GND_(CASE)) U10.P4(GND_(SUPPLY_&_SIGNAL))
FPGA_MAC_PPS_DIFF_IN0: R11.2 U3.3(DI2) ; off-sheet FPGA_MAC_PPS_DIFF_IN0
FPGA_MAC_PPS_IN1-: R10.2 U3.2(DI1) ; off-sheet FPGA_MAC_PPS_IN1-
FPGA_MAC_PPSDIFF_OUT: U4.7(ROUT1) ; off-sheet FPGA_MAC_PPSDIFF_OUT
MAC_ALARM: J31.20 U10.20(ALARM) ; off-sheet MAC_ALARM
MAC_BITE: SKT4.1 U10.P6(BITE) ; off-sheet MAC_BITE
MAC_FREQ_CTRL: SKT2.1 U10.P1(FREQ_CTRL_IN) ; off-sheet MAC_FREQ_CTRL
MAC_PPS_IN: SKT8.1 U10.P9(PPS-IN) ; off-sheet MAC_PPS_IN
MAC_PPS_IN0+: J31.5 U3.6(DO+2) U10.5(PPS-IN_0+) ; off-sheet MAC_PPS_IN0+
MAC_PPS_IN0-: J31.7 U3.5(DO-2) U10.7(PPS-IN_0-) ; off-sheet MAC_PPS_IN0-
MAC_PPS_IN1+: J31.1 U3.7(DO+1) U10.1(PPS-IN_1+) ; off-sheet MAC_PPS_IN1+
MAC_PPS_IN1-: J31.3 U3.8(DO-1) U10.3(PPS-IN_1-) ; off-sheet MAC_PPS_IN1-
MAC_PPS_OUT: SKT10.1 U10.P10(PPS-OUT) ; off-sheet MAC_PPS_OUT
MAC_PPS_OUT+: J31.17 R12.2 U4.2(RIN1+) U10.17(PPS-OUT_+) ; off-sheet MAC_PPS_OUT+
MAC_PPS_OUT-: J31.19 R12.1 U4.1(RIN1-) U10.19(PPS-OUT_-) ; off-sheet MAC_PPS_OUT-
MAC_RF_OUT: SKT5.1 U10.P3(RF_OUT) ; off-sheet MAC_RF_OUT
MAC_RX: SKT3.1 U10.P7(RS-232_TX) ; off-sheet MAC_RX
MAC_TX: SKT1.1 U10.P8(RS-232_RX) ; off-sheet MAC_TX
MAC_USB+: J31.2 U10.2(USB_DATA_+) ; off-sheet MAC_USB+
MAC_USB-: J31.4 U10.4(USB_DATA_-) ; off-sheet MAC_USB-
MAC_USB_PWR: J31.6 U10.6(USB_POWER) ; off-sheet MAC_USB_PWR
MAC_VCC: C62.1 C63.2 R45.1 R46.1 R47.1 SKT7.1 U10.P5(VCC)

Not connected (* = marked no-connect by the designer): J31 10* 11* 12* 13* 14* 16* 18*; U4 3(RIN2+)* 4(RIN2-)* 6(ROUT2)*; U10 10(NC)* 11(NC)* 12(NC)* 13(NC)* 14(NC)* 16(NC)* 18(NC)*

### Notes on the sheet
- MAC
- 12V and 3.3V Option for different Atomic clocks
- SHEET
- REV
- timingcard.com <http://timingcard.com>
- DATE
- OF

### Library data of the parts
C23 C24 C63 = CMP-2006-00003-1: C0603X104K5RACAUTO; Manufacturer: Kemet; Part Number: C0603X104K5RACAUTO
C62 = CAP_0805_10UF_25V: CAP, CER, 10.UF, 25V, 10%, X5R, 0805; MFG PART NUM: TMK212BBJ106KG-T; VALENTIUM PART NUM: <VALENTIUM>; MFG NAME: TAIYO YUDEN; MAXTEMP: 85C; MINTEMP: -55C; DESC: CAP, CER, 10.UF, 10V, 10%, X5R, 0805; MODIFY DATE: 10/23/2013; CATEGORY: CAP, CER; Date: 4/11/2006 3:37:28 PM; SHEETPART: *; P1: 10%; P2: 25V; P3: X5R; Size: 0805; Supplier 1: MOUSER; Supplier Part Number 1: 963-TMK212BBJ106KG-T
R10 R11 = CMP-2000-06942-1: Chip Resistor, 4.7 KOhm, +/- 1%, 0.1 W, -55 to 155 degC, 0603 (1608 Metric), RoHS, Tape and Reel RC0603FR-074K7L; Manufacturer: Yageo; Power Rating: 100mW; Temperature Coefficient: 100PPM/C; Resistance: 4.7kOhms; Voltage Rating: 50V; Package Reference: 0603; Series: RC; Datasheet Version: Rev. 7, 05/2017; Packaging: Reel; Termination Style: SMD/SMT; Datasheet URL: http://www.yageo.com/documents/recent/PYu-RC_Group_51_RoHS_L_7.pdf; Manufacturer URL: http://www.yageo.com/; Package Description: 2-Pin Surface Mount Device, Body 1.6 x 0.8 mm; Case Code - mm: 1608; Case Code - in: 0603; Mounting Technology: SurfaceMount; Operating Temperature Range: -55Cto+155C; Tolerance: 1%; Product: ThickFilmResistorsGeneralPurpose
R12 = CMP-2000-03854-1: Part Number: CRCW0603110RFKEA; Manufacturer: Vishay Dale
R45-R47 = CMP-2003-04873-1: Part Number: CRCW12060000Z0EAHP; Manufacturer: Vishay Dale
SKT1-SKT10 = 0332-0-43-80-18-27-10-0: Solder socket for pin headers
U3 = CMP-0058-01000-2: Automotive LVDS Dual Differential Driver, 8-pin Narrow SOIC; Manufacturer: National Semiconductor; PackageTopMarking: NSZXTT*90LV0*27AQM; CompType: Interface IC; PowerWise: N; DatasheetVersion: Oct-2008; PinCount: 8; RevisionNote: Component URLs added; Code_IPC: SOIC127P600-8; ComponentLink1URL: http://www.national.com/ds/DS/DS90LV027AQ.pdf; ComponentLink3Description: M08A Package Page; PackageDescription: SOIC Narrow, 4.9 x 3.9 x 1.45mm, 8 Lead, 1.27mm Pitch; ComponentLink2Description: DS90LV027AQ Web Page; ComponentLink2URL: http://www.national.com/pf/DS/DS90LV027AQ.html; RoHS: Y; Code_JEDEC: MS-012-AA; PackageReference: M08A; PackageVersion: revM, May-2009; ComponentLink1Description: DS90LV027AQ Datasheet; ComponentLink3URL: http://www.national.com/packaging/folders/m08a.html
U4 = CMP-0058-01010-2: Automotive LVDS Dual Differential Line Receiver, 8-pin Narrow SOIC; Manufacturer: National Semiconductor; PowerWise: N; PackageTopMarking: NSZXTT*90LV0*28AQM; CompType: Interface IC; DatasheetVersion: Oct-2008; PackageReference: M08A; RevisionNote: Component URLs added; Code_JEDEC: MS-012-AA; PackageVersion: revM, May-2009; ComponentLink1URL: http://www.national.com/ds/DS/DS90LV028AQ.pdf; PinCount: 8; ComponentLink3Description: M08A Package Page; ComponentLink1Description: DS90LV028AQ Datasheet; Code_IPC: SOIC127P600-8; RoHS: Y; ComponentLink2URL: http://www.national.com/pf/DS/DS90LV028AQ.html; PackageDescription: SOIC Narrow, 4.9 x 3.9 x 1.45mm, 8 Lead, 1.27mm Pitch; ComponentLink2Description: DS90LV028AQ Web Page; ComponentLink3URL: http://www.national.com/packaging/folders/m08a.html
U10 = MAC-SA5X: MOD, MAC, MAC-SA5X, ATOMIC CLOCK; VELENTIUM PART NUM: <V PART NUM>; MFG NAME: MICROCHIP; MAXTEMP: 85C; MINTEMP: -40C; OTHER: AEC-Q200; MODIFY DATE: 3/22/2006 1:36:44 PM; MFG PART NUM: MAC-SA5X; CATEGORY: MOD; P1: ATOMIC CLOCK; SHEETPART: *; DESC: MOD, MAC, MAC-SA5X, ATOMIC CLOCK
J31 = SA53_Header: Supplier 1: Digi-Key
J39-J42 = SA53 Screw: Supplier 1: Digi-Key

## Sheet 10-M2_GPS.SchDoc
size B
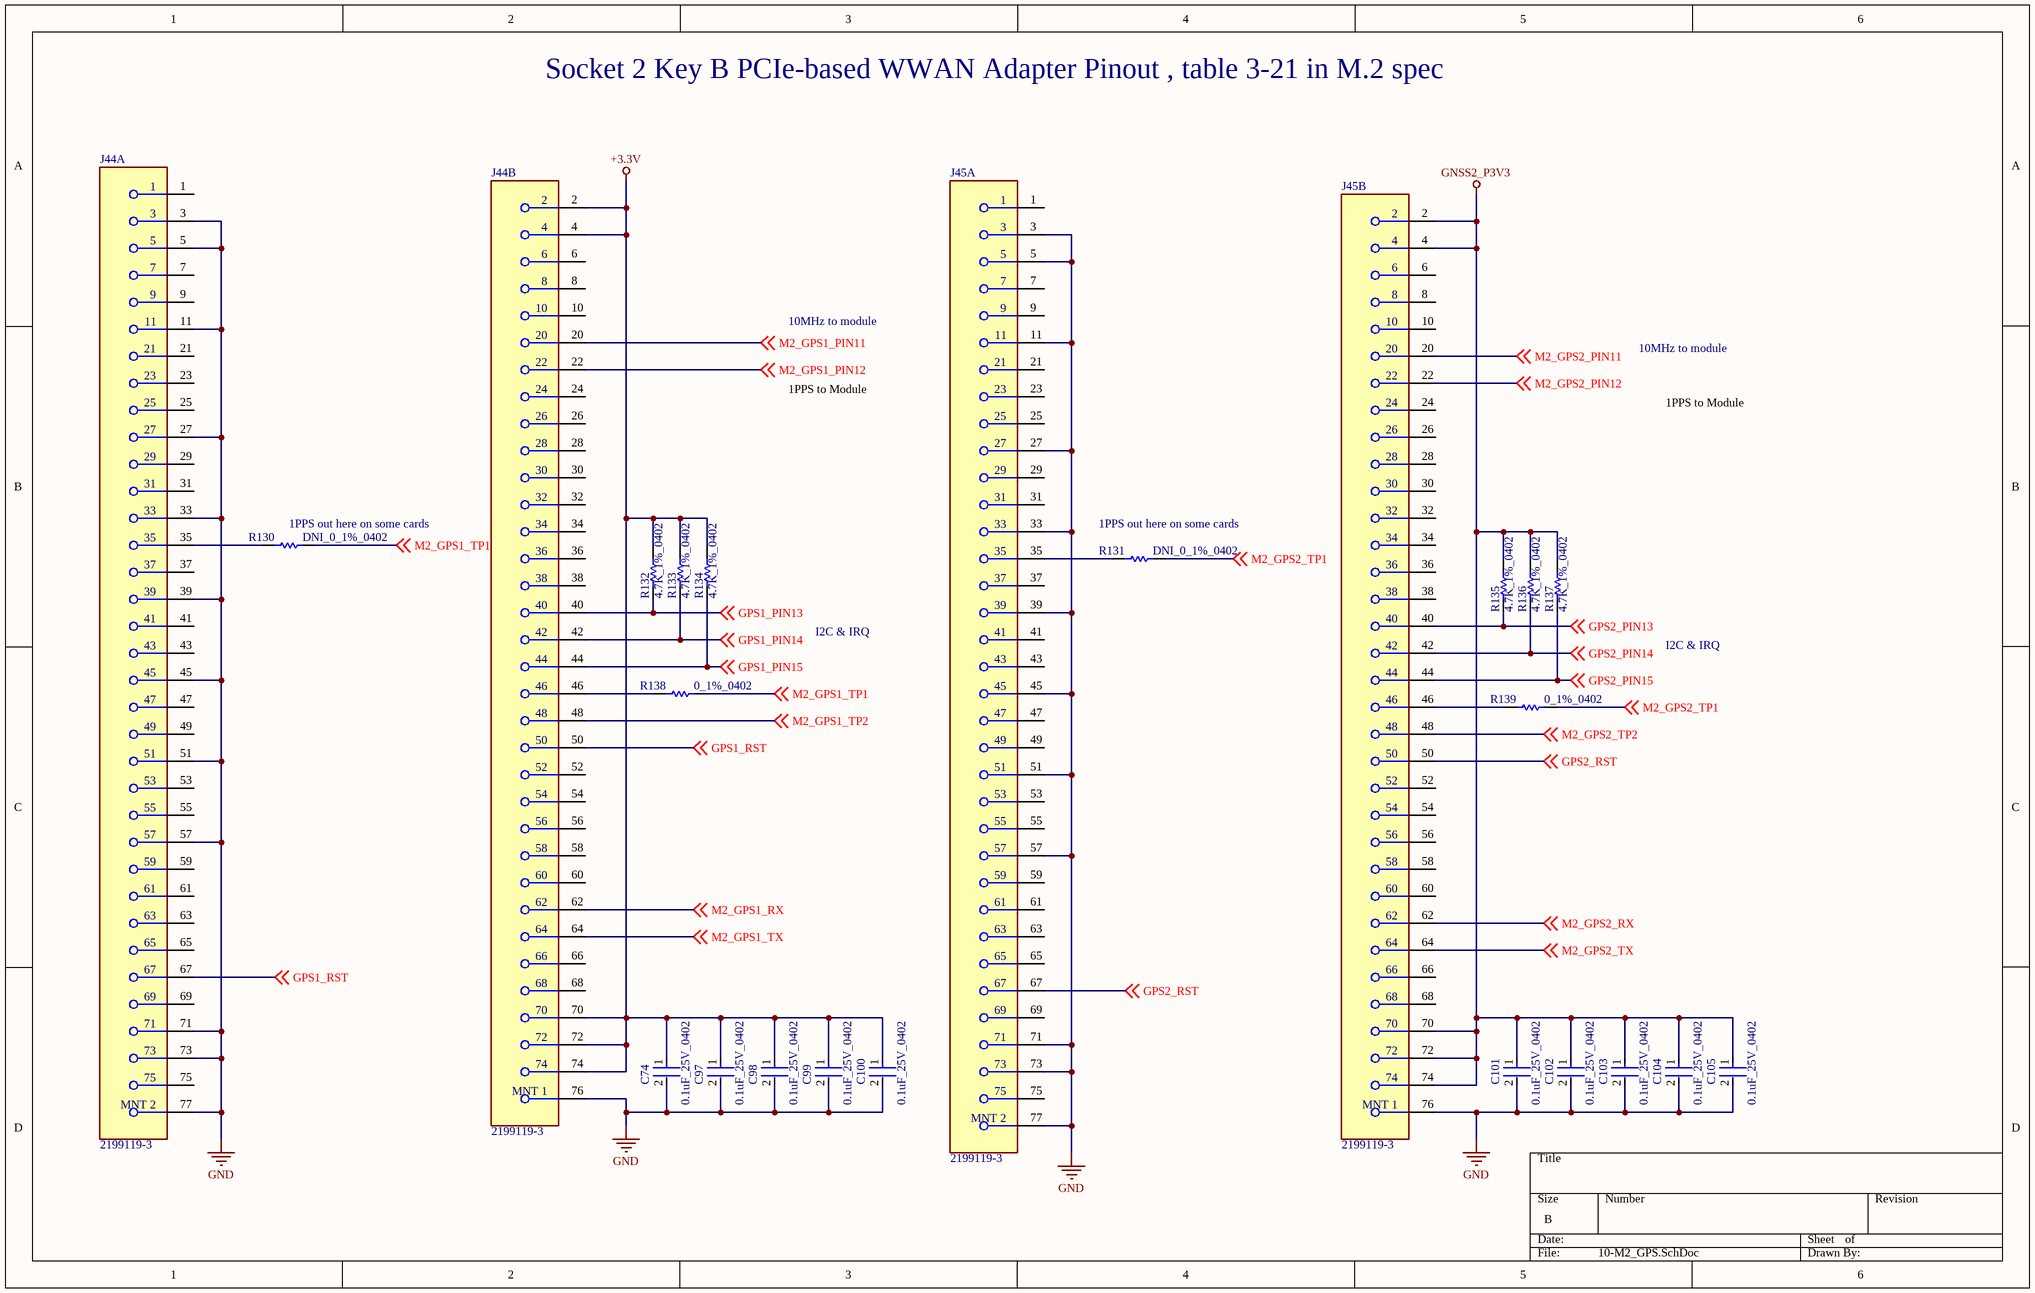
[diagram p6: 10-M2_GPS.SchDoc]

### Parts
C74  0.1uF_25V_0402  [FP-0402-L_1_0_1-W_0_5_0_1-IPC_C]
C97  0.1uF_25V_0402  [FP-0402-L_1_0_1-W_0_5_0_1-IPC_C]
C98  0.1uF_25V_0402  [FP-0402-L_1_0_1-W_0_5_0_1-IPC_C]
C99  0.1uF_25V_0402  [FP-0402-L_1_0_1-W_0_5_0_1-IPC_C]
C100  0.1uF_25V_0402  [FP-0402-L_1_0_1-W_0_5_0_1-IPC_C]
C101  0.1uF_25V_0402  [FP-0402-L_1_0_1-W_0_5_0_1-IPC_C]
C102  0.1uF_25V_0402  [FP-0402-L_1_0_1-W_0_5_0_1-IPC_C]
C103  0.1uF_25V_0402  [FP-0402-L_1_0_1-W_0_5_0_1-IPC_C]
C104  0.1uF_25V_0402  [FP-0402-L_1_0_1-W_0_5_0_1-IPC_C]
C105  0.1uF_25V_0402  [FP-0402-L_1_0_1-W_0_5_0_1-IPC_C]
J44  2199119-3  [FP-2199119-3-MFG]  (parts A,B of 2)
J45  2199119-3  [FP-2199119-3-MFG]  (parts A,B of 2)
R130  DNI_0_1%_0402  [RESC1005X40X25LL05T05]  (no BOM)
R131  DNI_0_1%_0402  [RESC1005X40X25LL05T05]  (no BOM)
R132  4.7K_1%_0402  [RESC1005X40X25NL10T10]
R133  4.7K_1%_0402  [RESC1005X40X25NL10T10]
R134  4.7K_1%_0402  [RESC1005X40X25NL10T10]
R135  4.7K_1%_0402  [RESC1005X40X25NL10T10]
R136  4.7K_1%_0402  [RESC1005X40X25NL10T10]
R137  4.7K_1%_0402  [RESC1005X40X25NL10T10]
R138  0_1%_0402  [RESC1005X40X25LL05T05]
R139  0_1%_0402  [RESC1005X40X25LL05T05]

### Nets
+3.3V: C74.1 C97.1 C98.1 C99.1 C100.1 J44.2 J44.4 J44.70 J44.72 J44.74 R132.2 R133.2 R134.2
GND: C74.2 C97.2 C98.2 C99.2 C100.2 C101.2 C102.2 C103.2 C104.2 C105.2 J44.3 J44.5 J44.11 J44.27 J44.33 J44.39 J44.45 J44.51 J44.57 J44.71 J44.73 J44.76(MNT_1) J44.77(MNT_2) J45.3 J45.5 J45.11 J45.27 J45.33 J45.39 J45.45 J45.51 J45.57 J45.71 J45.73 J45.76(MNT_1) J45.77(MNT_2)
GNSS2_P3V3: C101.1 C102.1 C103.1 C104.1 C105.1 J45.2 J45.4 J45.70 J45.72 J45.74 R135.2 R136.2 R137.2
GPS1_PIN13: J44.40 R132.1 ; off-sheet GPS1_PIN13
GPS1_PIN14: J44.42 R133.1 ; off-sheet GPS1_PIN14
GPS1_PIN15: J44.44 R134.1 ; off-sheet GPS1_PIN15
GPS1_RST: J44.50 J44.67 ; off-sheet GPS1_RST
GPS2_PIN13: J45.40 R135.1 ; off-sheet GPS2_PIN13
GPS2_PIN14: J45.42 R136.1 ; off-sheet GPS2_PIN14
GPS2_PIN15: J45.44 R137.1 ; off-sheet GPS2_PIN15
GPS2_RST: J45.50 J45.67 ; off-sheet GPS2_RST
M2_GPS1_PIN11: J44.20 ; off-sheet M2_GPS1_PIN11
M2_GPS1_PIN12: J44.22 ; off-sheet M2_GPS1_PIN12
M2_GPS1_RX: J44.62 ; off-sheet M2_GPS1_RX
M2_GPS1_TP1: R130.2 R138.2 ; off-sheet M2_GPS1_TP1
M2_GPS1_TP2: J44.48 ; off-sheet M2_GPS1_TP2
M2_GPS1_TX: J44.64 ; off-sheet M2_GPS1_TX
M2_GPS2_PIN11: J45.20 ; off-sheet M2_GPS2_PIN11
M2_GPS2_PIN12: J45.22 ; off-sheet M2_GPS2_PIN12
M2_GPS2_RX: J45.62 ; off-sheet M2_GPS2_RX
M2_GPS2_TP1: R131.2 R139.2 ; off-sheet M2_GPS2_TP1
M2_GPS2_TP2: J45.48 ; off-sheet M2_GPS2_TP2
M2_GPS2_TX: J45.64 ; off-sheet M2_GPS2_TX
NetJ44_35: J44.35 R130.1
NetJ44_46: J44.46 R138.1
NetJ45_35: J45.35 R131.1
NetJ45_46: J45.46 R139.1

Not connected (* = marked no-connect by the designer): J44 1 6 7 8 9 10 21 23 24 25 26 28 29 30 31 32 34 36 37 38 41 43 47 49 52 53 54 55 56 58 59 60 61 63 65 66 68 69 75; J45 1 6 7 8 9 10 21 23 24 25 26 28 29 30 31 32 34 36 37 38 41 43 47 49 52 53 54 55 56 58 59 60 61 63 65 66 68 69 75

### Notes on the sheet
- Socket 2 Key B PCIe-based WWAN Adapter Pinout , table 3-21 in M.2 spec
- 10MHz to module
- 1PPS to Module
- (near R130) 1PPS out here on some cards
- (near R131) 1PPS out here on some cards
- I2C & IRQ

### Library data of the parts
C74 C97-C105 = CMP-2008-02519-2: as C33 on sheet 05-GPS_IMU_SENSORS; Package Quantity: 1; Capacitance: 100nF; Min Operating Temperature: -55°C; Voltage: 25V; Voltage Rating: 25V; Construction: Flat; Max Operating Temperature: 125°C; Radiation Hardening: No; Depth: 0.5mm; Thickness: 0.022inch; Voltage Rating (DC): 25V; Number of Pins: 2; Lead Free: Lead Free; Series: -; REACH SVHC: No SVHC; Length: 1mm; Dielectric: X7R; RoHS Compliant: Yes; Mount: Surface Mount; Packaging: Tape and Reel; Case/Package: 0402; Case Code (Imperial): 0402; Termination: SMD/SMT; Width: 0.02inch; Case Code (Metric): 1005; Tolerance: 10%
J44 J45 = CMP-03365-000004-1: CONN M.2 FEMALE 67POS 0.020 GOLD; Contact Current Rating: 500mA; Number of Contacts: 67; PCB Mounting Orientation: Right Angle; Pitch: 0.5mm; Voltage Rating: 50V; Insulation Resistance: 500MR; Row Spacing: 7.55mm; Orientation: Right Angle; Length: 0.862inch; Radiation Hardening: No; Mount: Surface Mount; Contact Plating: Gold; Contact Material: Copper Alloy; Width: 8.7mm; Number of Rows: 2; Color: Black; ELV: Compliant; Housing Color: Black; Number of Positions: 67; Housing Material: Thermoplastic; Gender: Female; Min Operating Temperature: -40°C; Max Operating Temperature: 80°C; RoHS Compliant: Yes; Package Quantity: 1200; Packaging: Tape and Reel; Height: 3.2mm; Termination: Solder; Insulation Material: Thermoplastic; Max Voltage Rating (AC): 50V; Current Rating: 500mA
R130 R131 R138 R139 = CMP-2000-07451-1: as R48 on sheet 05-GPS_IMU_SENSORS; Number of Terminations: 2; Mount: SurfaceMount; Height: 0.35mm; Packaging: TapeandReel; Contact Plating: Tin; Manufacturer URL: http://www.panasonic.com/; Composition: ThickFilm; Max Operating Temperature: 155degC; REACH SVHC: NoSVHC; Case/Package: 0402; Package Reference: 402; Depth: 0.5mm; Package Description: 2-Pin Surface Mount Device, Body 1 x 0.5 mm; Datasheet URL: https://industrial.panasonic.com/cdbs/www-data/pdf/RDA0000/AOA0000C301.pdf; RoHSCompliant: True; Case Code (Imperial): 0402; Military Standard: Not; Min Operating Temperature: -55degC; Power Rating: 100mW; Datasheet Version: 03/2015; Length: 1mm; Case Code (Metric): 1005; Termination: SMD/SMT; Mounting Technology: SurfaceMount; Voltage Rating: 50V; Width: 0.02inch; Package Quantity: 1; Lead Free: LeadFree; Radiation Hardening: No
R132-R137 = CMP-2002-05217-1: Manufacturer: Bourns; Part Number: CR0402-FX-4701GLF

## Sheet 11-M2_RCB_MUX.SchDoc
size B
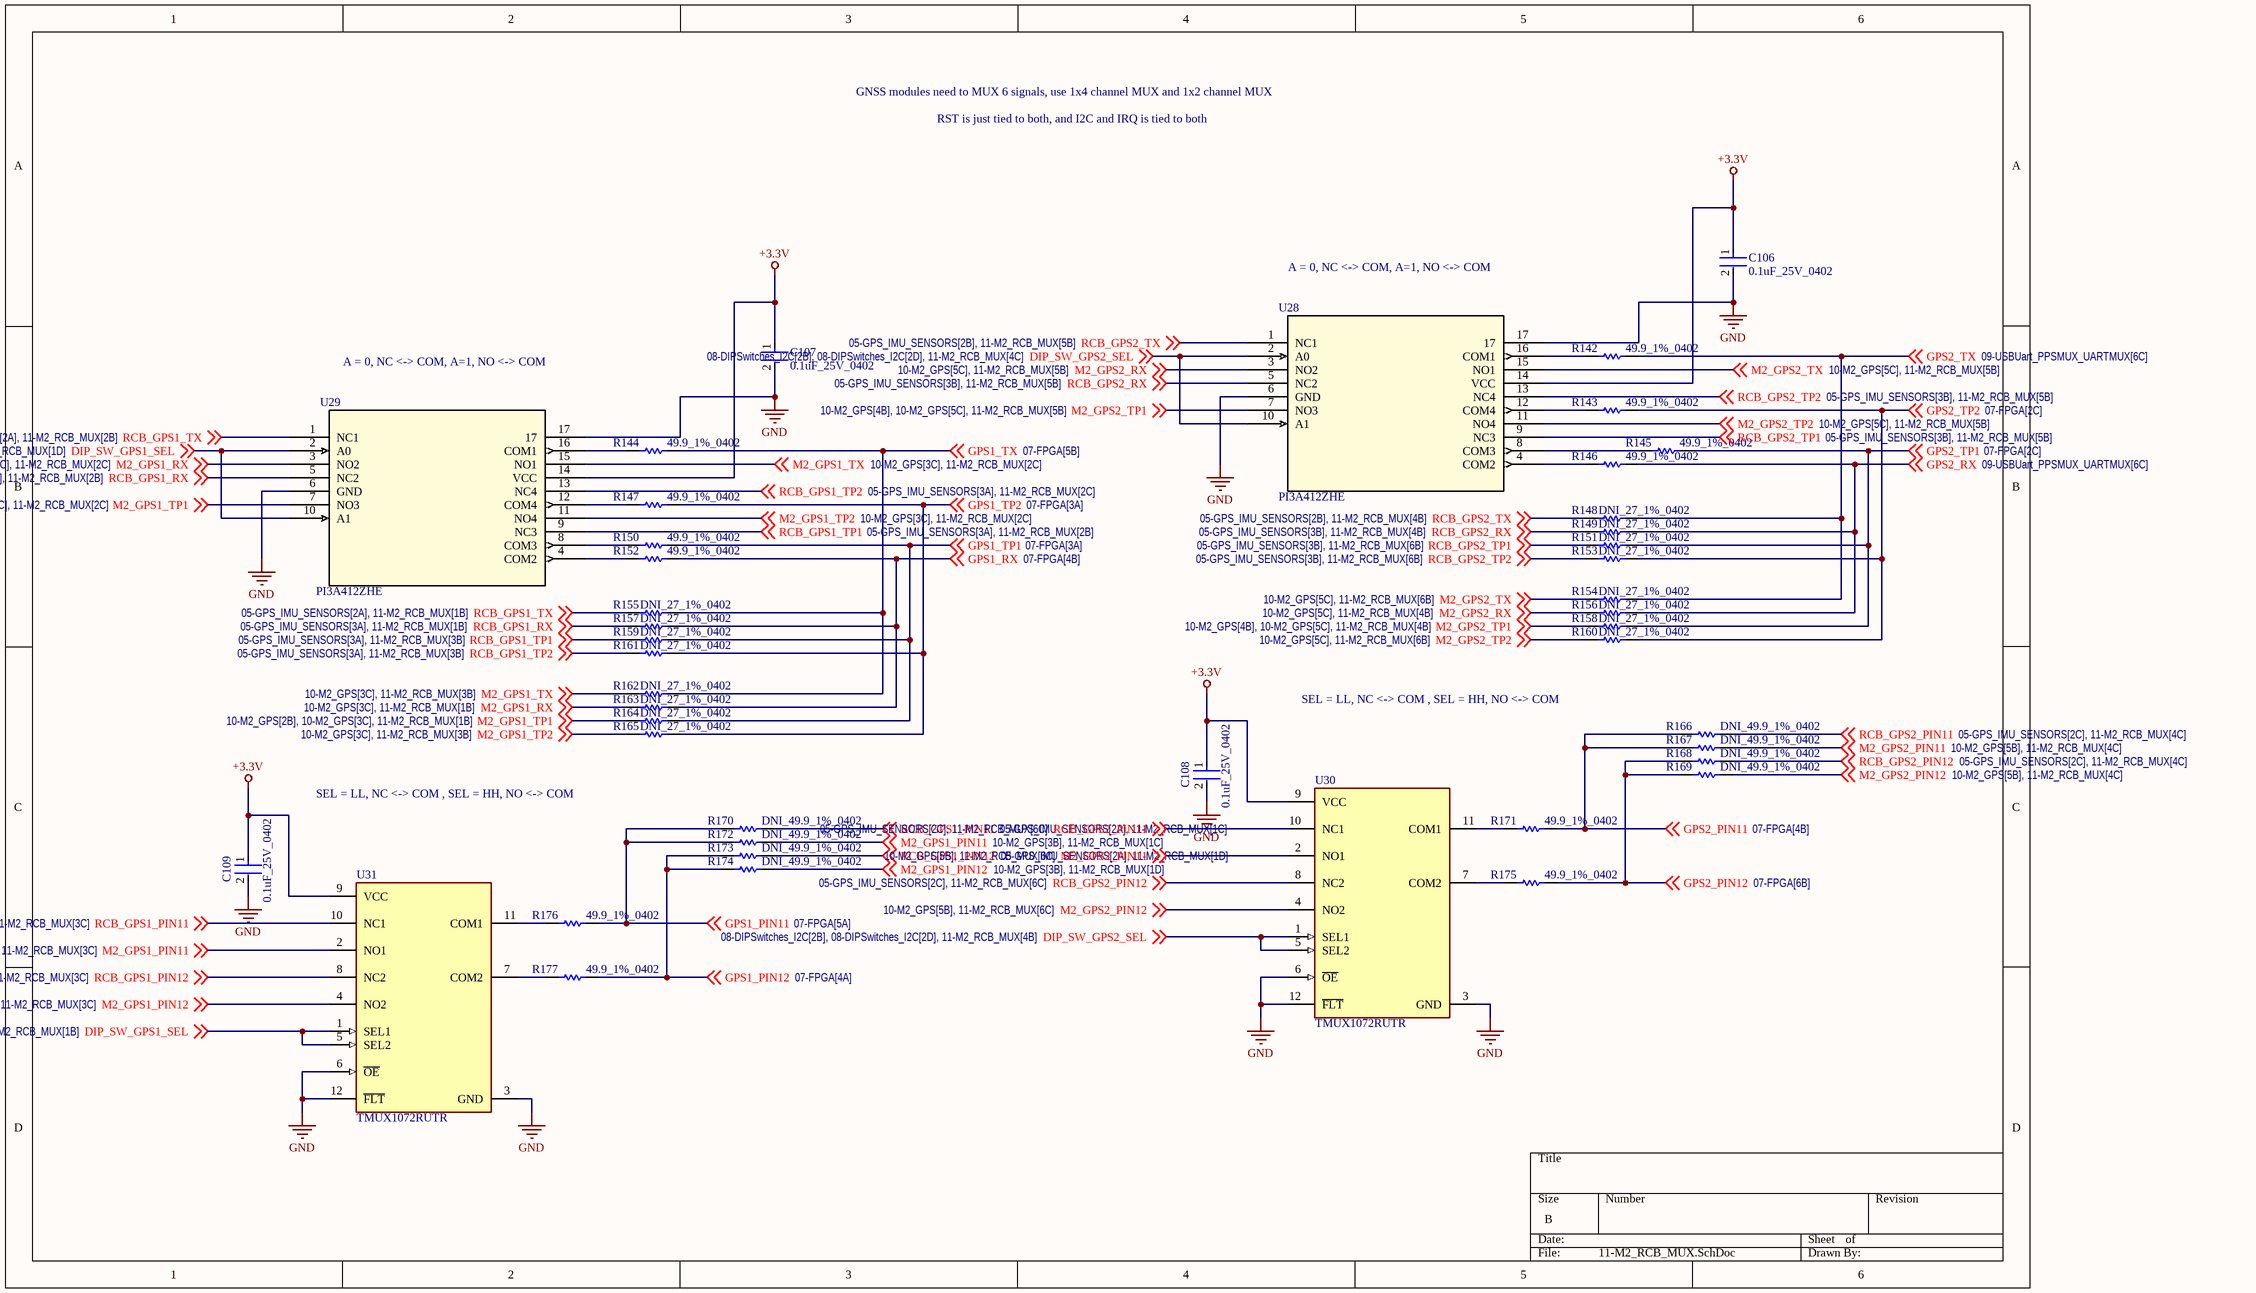
[diagram p7: 11-M2_RCB_MUX.SchDoc]

### Parts
C106  0.1uF_25V_0402  [FP-0402-L_1_0_1-W_0_5_0_1-IPC_C]
C107  0.1uF_25V_0402  [FP-0402-L_1_0_1-W_0_5_0_1-IPC_C]
C108  0.1uF_25V_0402  [FP-0402-L_1_0_1-W_0_5_0_1-IPC_C]
C109  0.1uF_25V_0402  [FP-0402-L_1_0_1-W_0_5_0_1-IPC_C]
R142  49.9_1%_0402  [RESC1005X40X25LL05T10]
R143  49.9_1%_0402  [RESC1005X40X25LL05T10]
R144  49.9_1%_0402  [RESC1005X40X25LL05T10]
R145  49.9_1%_0402  [RESC1005X40X25LL05T10]
R146  49.9_1%_0402  [RESC1005X40X25LL05T10]
R147  49.9_1%_0402  [RESC1005X40X25LL05T10]
R148  DNI_27_1%_0402  [RESC1005X40X25NL05T05]  (no BOM)
R149  DNI_27_1%_0402  [RESC1005X40X25NL05T05]  (no BOM)
R150  49.9_1%_0402  [RESC1005X40X25LL05T10]
R151  DNI_27_1%_0402  [RESC1005X40X25NL05T05]  (no BOM)
R152  49.9_1%_0402  [RESC1005X40X25LL05T10]
R153  DNI_27_1%_0402  [RESC1005X40X25NL05T05]  (no BOM)
R154  DNI_27_1%_0402  [RESC1005X40X25NL05T05]  (no BOM)
R155  DNI_27_1%_0402  [RESC1005X40X25NL05T05]  (no BOM)
R156  DNI_27_1%_0402  [RESC1005X40X25NL05T05]  (no BOM)
R157  DNI_27_1%_0402  [RESC1005X40X25NL05T05]  (no BOM)
R158  DNI_27_1%_0402  [RESC1005X40X25NL05T05]  (no BOM)
R159  DNI_27_1%_0402  [RESC1005X40X25NL05T05]  (no BOM)
R160  DNI_27_1%_0402  [RESC1005X40X25NL05T05]  (no BOM)
R161  DNI_27_1%_0402  [RESC1005X40X25NL05T05]  (no BOM)
R162  DNI_27_1%_0402  [RESC1005X40X25NL05T05]  (no BOM)
R163  DNI_27_1%_0402  [RESC1005X40X25NL05T05]  (no BOM)
R164  DNI_27_1%_0402  [RESC1005X40X25NL05T05]  (no BOM)
R165  DNI_27_1%_0402  [RESC1005X40X25NL05T05]  (no BOM)
R166  DNI_49.9_1%_0402  [RESC1005X40X25LL05T10]  (no BOM)
R167  DNI_49.9_1%_0402  [RESC1005X40X25LL05T10]  (no BOM)
R168  DNI_49.9_1%_0402  [RESC1005X40X25LL05T10]  (no BOM)
R169  DNI_49.9_1%_0402  [RESC1005X40X25LL05T10]  (no BOM)
R170  DNI_49.9_1%_0402  [RESC1005X40X25LL05T10]  (no BOM)
R171  49.9_1%_0402  [RESC1005X40X25LL05T10]
R172  DNI_49.9_1%_0402  [RESC1005X40X25LL05T10]  (no BOM)
R173  DNI_49.9_1%_0402  [RESC1005X40X25LL05T10]  (no BOM)
R174  DNI_49.9_1%_0402  [RESC1005X40X25LL05T10]  (no BOM)
R175  49.9_1%_0402  [RESC1005X40X25LL05T10]
R176  49.9_1%_0402  [RESC1005X40X25LL05T10]
R177  49.9_1%_0402  [RESC1005X40X25LL05T10]
U28  PI3A412ZHE  [ZH16_PER]
U29  PI3A412ZHE  [ZH16_PER]
U30  TMUX1072RUTR  [FP-RUT0012A-MFG]
U31  TMUX1072RUTR  [FP-RUT0012A-MFG]

### Nets
+3.3V: C106.1 C107.1 C108.1 C109.1 U28.14(VCC) U29.14(VCC) U30.9(VCC) U31.9(VCC)
GND: C106.2 C107.2 C108.2 C109.2 U28.6(GND) U28.17 U29.6(GND) U29.17 U30.3(GND) U30.6(~{OE}) U30.12(~{FLT}) U31.3(GND) U31.6(~{OE}) U31.12(~{FLT})
DIP_SW_GPS1_SEL: U29.2(A0) U29.10(A1) U31.1(SEL1) U31.5(SEL2) ; off-sheet DIP_SW_GPS1_SEL
DIP_SW_GPS2_SEL: U28.2(A0) U28.10(A1) U30.1(SEL1) U30.5(SEL2) ; off-sheet DIP_SW_GPS2_SEL
GPS1_PIN11: R170.1 R172.1 R176.2 ; off-sheet GPS1_PIN11
GPS1_PIN12: R173.1 R174.1 R177.2 ; off-sheet GPS1_PIN12
GPS1_RX: R152.2 R157.2 R163.2 ; off-sheet GPS1_RX
GPS1_TP1: R150.2 R159.2 R164.2 ; off-sheet GPS1_TP1
GPS1_TP2: R147.2 R161.2 R165.2 ; off-sheet GPS1_TP2
GPS1_TX: R144.2 R155.2 R162.2 ; off-sheet GPS1_TX
GPS2_PIN11: R166.1 R167.1 R171.2 ; off-sheet GPS2_PIN11
GPS2_PIN12: R168.1 R169.1 R175.2 ; off-sheet GPS2_PIN12
GPS2_RX: R146.2 R149.2 R156.2 ; off-sheet GPS2_RX
GPS2_TP1: R145.2 R151.2 R158.2 ; off-sheet GPS2_TP1
GPS2_TP2: R143.2 R153.2 R160.2 ; off-sheet GPS2_TP2
GPS2_TX: R142.2 R148.2 R154.2 ; off-sheet GPS2_TX
M2_GPS1_PIN11: R172.2 U31.2(NO1) ; off-sheet M2_GPS1_PIN11
M2_GPS1_PIN12: R174.2 U31.4(NO2) ; off-sheet M2_GPS1_PIN12
M2_GPS1_RX: R163.1 U29.3(NO2) ; off-sheet M2_GPS1_RX
M2_GPS1_TP1: R164.1 U29.7(NO3) ; off-sheet M2_GPS1_TP1
M2_GPS1_TP2: R165.1 U29.11(NO4) ; off-sheet M2_GPS1_TP2
M2_GPS1_TX: R162.1 U29.15(NO1) ; off-sheet M2_GPS1_TX
M2_GPS2_PIN11: R167.2 U30.2(NO1) ; off-sheet M2_GPS2_PIN11
M2_GPS2_PIN12: R169.2 U30.4(NO2) ; off-sheet M2_GPS2_PIN12
M2_GPS2_RX: R156.1 U28.3(NO2) ; off-sheet M2_GPS2_RX
M2_GPS2_TP1: R158.1 U28.7(NO3) ; off-sheet M2_GPS2_TP1
M2_GPS2_TP2: R160.1 U28.11(NO4) ; off-sheet M2_GPS2_TP2
M2_GPS2_TX: R154.1 U28.15(NO1) ; off-sheet M2_GPS2_TX
RCB_GPS1_PIN11: R170.2 U31.10(NC1) ; off-sheet RCB_GPS1_PIN11
RCB_GPS1_PIN12: R173.2 U31.8(NC2) ; off-sheet RCB_GPS1_PIN12
RCB_GPS1_RX: R157.1 U29.5(NC2) ; off-sheet RCB_GPS1_RX
RCB_GPS1_TP1: R159.1 U29.9(NC3) ; off-sheet RCB_GPS1_TP1
RCB_GPS1_TP2: R161.1 U29.13(NC4) ; off-sheet RCB_GPS1_TP2
RCB_GPS1_TX: R155.1 U29.1(NC1) ; off-sheet RCB_GPS1_TX
RCB_GPS2_PIN11: R166.2 U30.10(NC1) ; off-sheet RCB_GPS2_PIN11
RCB_GPS2_PIN12: R168.2 U30.8(NC2) ; off-sheet RCB_GPS2_PIN12
RCB_GPS2_RX: R149.1 U28.5(NC2) ; off-sheet RCB_GPS2_RX
RCB_GPS2_TP1: R151.1 U28.9(NC3) ; off-sheet RCB_GPS2_TP1
RCB_GPS2_TP2: R153.1 U28.13(NC4) ; off-sheet RCB_GPS2_TP2
RCB_GPS2_TX: R148.1 U28.1(NC1) ; off-sheet RCB_GPS2_TX
NetR142_1: R142.1 U28.16(COM1)
NetR143_1: R143.1 U28.12(COM4)
NetR144_1: R144.1 U29.16(COM1)
NetR145_1: R145.1 U28.8(COM3)
NetR146_1: R146.1 U28.4(COM2)
NetR147_1: R147.1 U29.12(COM4)
NetR150_1: R150.1 U29.8(COM3)
NetR152_1: R152.1 U29.4(COM2)
NetR171_1: R171.1 U30.11(COM1)
NetR175_1: R175.1 U30.7(COM2)
NetR176_1: R176.1 U31.11(COM1)
NetR177_1: R177.1 U31.7(COM2)

### Notes on the sheet
- GNSS modules need to MUX 6 signals, use 1x4 channel MUX and 1x2 channel MUX
- RST is just tied to both, and I2C and IRQ is tied to both
- A = 0, NC <-> COM, A=1, NO <-> COM
- SEL = LL, NC <-> COM , SEL = HH, NO <-> COM

### Library data of the parts
C106-C109 = CMP-2008-02519-2: as C33 on sheet 05-GPS_IMU_SENSORS; Package Quantity: 1; Capacitance: 100nF; Min Operating Temperature: -55°C; Voltage: 25V; Voltage Rating: 25V; Construction: Flat; Max Operating Temperature: 125°C; Radiation Hardening: No; Depth: 0.5mm; Thickness: 0.022inch; Voltage Rating (DC): 25V; Number of Pins: 2; Lead Free: Lead Free; Series: -; REACH SVHC: No SVHC; Length: 1mm; Dielectric: X7R; RoHS Compliant: Yes; Mount: Surface Mount; Packaging: Tape and Reel; Case/Package: 0402; Case Code (Imperial): 0402; Termination: SMD/SMT; Width: 0.02inch; Case Code (Metric): 1005; Tolerance: 10%
R142-R147 R150 R152 R166-R177 = CMP-2002-07709-1: Manufacturer: Yageo / Phycomp; Part Number: RC0402FR-0749R9L
R148 R149 R151 R153-R165 = CMP-2002-08434-1: Part Number: CRCW040227R0FKED; Manufacturer: Vishay Dale
U28 U29 = PI3A412ZHE: No Description Available; Mfr_Name: Pericom; RefDes: RefDes; Type: Type
U30 U31 = CMP-04892-000114-1: IC SWITCH SPDT DUAL 12UQFN; Number of Circuits: 2; -3db Bandwidth: 1.2GHz; On-State Resistance: 18R; Number of Pins: 12; Min Operating Temperature: -40°C; RoHS Compliant: Yes; Max Operating Temperature: 125°C; Number of Channels: 2; Packaging: Tape and Reel

## Nets that join several sheets
+3.3V: 01-USER_IO (18 pins), 02-USER_IO_STATUS (15 pins), 03-POWER (21 pins), 05-GPS_IMU_SENSORS (20 pins), 06-MAC (5 pins), 10-M2_GPS (13 pins), 11-M2_RCB_MUX (8 pins)
+5.0V: 03-POWER (10 pins), 05-GPS_IMU_SENSORS (11 pins), 06-MAC (R45.2)
+12V: 03-POWER (32 pins), 06-MAC (R46.2)
GND: 01-USER_IO (34 pins), 02-USER_IO_STATUS (10 pins), 03-POWER (92 pins), 05-GPS_IMU_SENSORS (52 pins), 06-MAC (18 pins), 10-M2_GPS (36 pins), 11-M2_RCB_MUX (14 pins)
GNSS2_P3V3: 05-GPS_IMU_SENSORS (7 pins), 10-M2_GPS (13 pins)
GPS1_PIN13: 05-GPS_IMU_SENSORS (J6.13), 10-M2_GPS (J44.40 R132.1)
GPS1_PIN14: 05-GPS_IMU_SENSORS (J6.14), 10-M2_GPS (J44.42 R133.1)
GPS1_PIN15: 05-GPS_IMU_SENSORS (J6.15), 10-M2_GPS (J44.44 R134.1)
GPS1_RST: 05-GPS_IMU_SENSORS (J6.4 U9.4), 10-M2_GPS (J44.50 J44.67)
GPS2_PIN13: 05-GPS_IMU_SENSORS (J13.13), 10-M2_GPS (J45.40 R135.1)
GPS2_PIN14: 05-GPS_IMU_SENSORS (J13.14), 10-M2_GPS (J45.42 R136.1)
GPS2_PIN15: 05-GPS_IMU_SENSORS (J13.15), 10-M2_GPS (J45.44 R137.1)
GPS2_RST: 05-GPS_IMU_SENSORS (J13.4 U15.4), 10-M2_GPS (J45.50 J45.67)
M2_GPS1_PIN11: 10-M2_GPS (J44.20), 11-M2_RCB_MUX (R172.2 U31.2)
M2_GPS1_PIN12: 10-M2_GPS (J44.22), 11-M2_RCB_MUX (R174.2 U31.4)
M2_GPS1_RX: 10-M2_GPS (J44.62), 11-M2_RCB_MUX (R163.1 U29.3)
M2_GPS1_TP1: 10-M2_GPS (R130.2 R138.2), 11-M2_RCB_MUX (R164.1 U29.7)
M2_GPS1_TP2: 10-M2_GPS (J44.48), 11-M2_RCB_MUX (R165.1 U29.11)
M2_GPS1_TX: 10-M2_GPS (J44.64), 11-M2_RCB_MUX (R162.1 U29.15)
M2_GPS2_PIN11: 10-M2_GPS (J45.20), 11-M2_RCB_MUX (R167.2 U30.2)
M2_GPS2_PIN12: 10-M2_GPS (J45.22), 11-M2_RCB_MUX (R169.2 U30.4)
M2_GPS2_RX: 10-M2_GPS (J45.62), 11-M2_RCB_MUX (R156.1 U28.3)
M2_GPS2_TP1: 10-M2_GPS (R131.2 R139.2), 11-M2_RCB_MUX (R158.1 U28.7)
M2_GPS2_TP2: 10-M2_GPS (J45.48), 11-M2_RCB_MUX (R160.1 U28.11)
M2_GPS2_TX: 10-M2_GPS (J45.64), 11-M2_RCB_MUX (R154.1 U28.15)
MAC_FREQ_CTRL: 05-GPS_IMU_SENSORS (R48.2 R186.2), 06-MAC (SKT2.1 U10.P1)
RCB_GPS1_PIN11: 05-GPS_IMU_SENSORS (J6.11), 11-M2_RCB_MUX (R170.2 U31.10)
RCB_GPS1_PIN12: 05-GPS_IMU_SENSORS (J6.12), 11-M2_RCB_MUX (R173.2 U31.8)
RCB_GPS1_RX: 05-GPS_IMU_SENSORS (J6.5 U9.5), 11-M2_RCB_MUX (R157.1 U29.5)
RCB_GPS1_TP1: 05-GPS_IMU_SENSORS (J6.6 U9.6), 11-M2_RCB_MUX (R159.1 U29.9)
RCB_GPS1_TP2: 05-GPS_IMU_SENSORS (J6.7 U9.7), 11-M2_RCB_MUX (R161.1 U29.13)
RCB_GPS1_TX: 05-GPS_IMU_SENSORS (J6.3 U9.3), 11-M2_RCB_MUX (R155.1 U29.1)
RCB_GPS2_PIN11: 05-GPS_IMU_SENSORS (J13.11), 11-M2_RCB_MUX (R166.2 U30.10)
RCB_GPS2_PIN12: 05-GPS_IMU_SENSORS (J13.12), 11-M2_RCB_MUX (R168.2 U30.8)
RCB_GPS2_RX: 05-GPS_IMU_SENSORS (J13.5 U15.5), 11-M2_RCB_MUX (R149.1 U28.5)
RCB_GPS2_TP1: 05-GPS_IMU_SENSORS (J13.6 U15.6), 11-M2_RCB_MUX (R151.1 U28.9)
RCB_GPS2_TP2: 05-GPS_IMU_SENSORS (J13.7 U15.7), 11-M2_RCB_MUX (R153.1 U28.13)
RCB_GPS2_TX: 05-GPS_IMU_SENSORS (J13.3 U15.3), 11-M2_RCB_MUX (R148.1 U28.1)
SENS_I2C_SCL: 02-USER_IO_STATUS (U6.7), 03-POWER (U2.4 U17.4 U19.4), 05-GPS_IMU_SENSORS (U13.19 U14.4)
SENS_I2C_SDA: 02-USER_IO_STATUS (U6.6), 03-POWER (U2.3 U17.3 U19.3), 05-GPS_IMU_SENSORS (U13.20 U14.3)